# EAGLE design 3dglove_p1 (EAGLE 7.2.0)
DRAWING_AUTHOR: Sean B. Harre
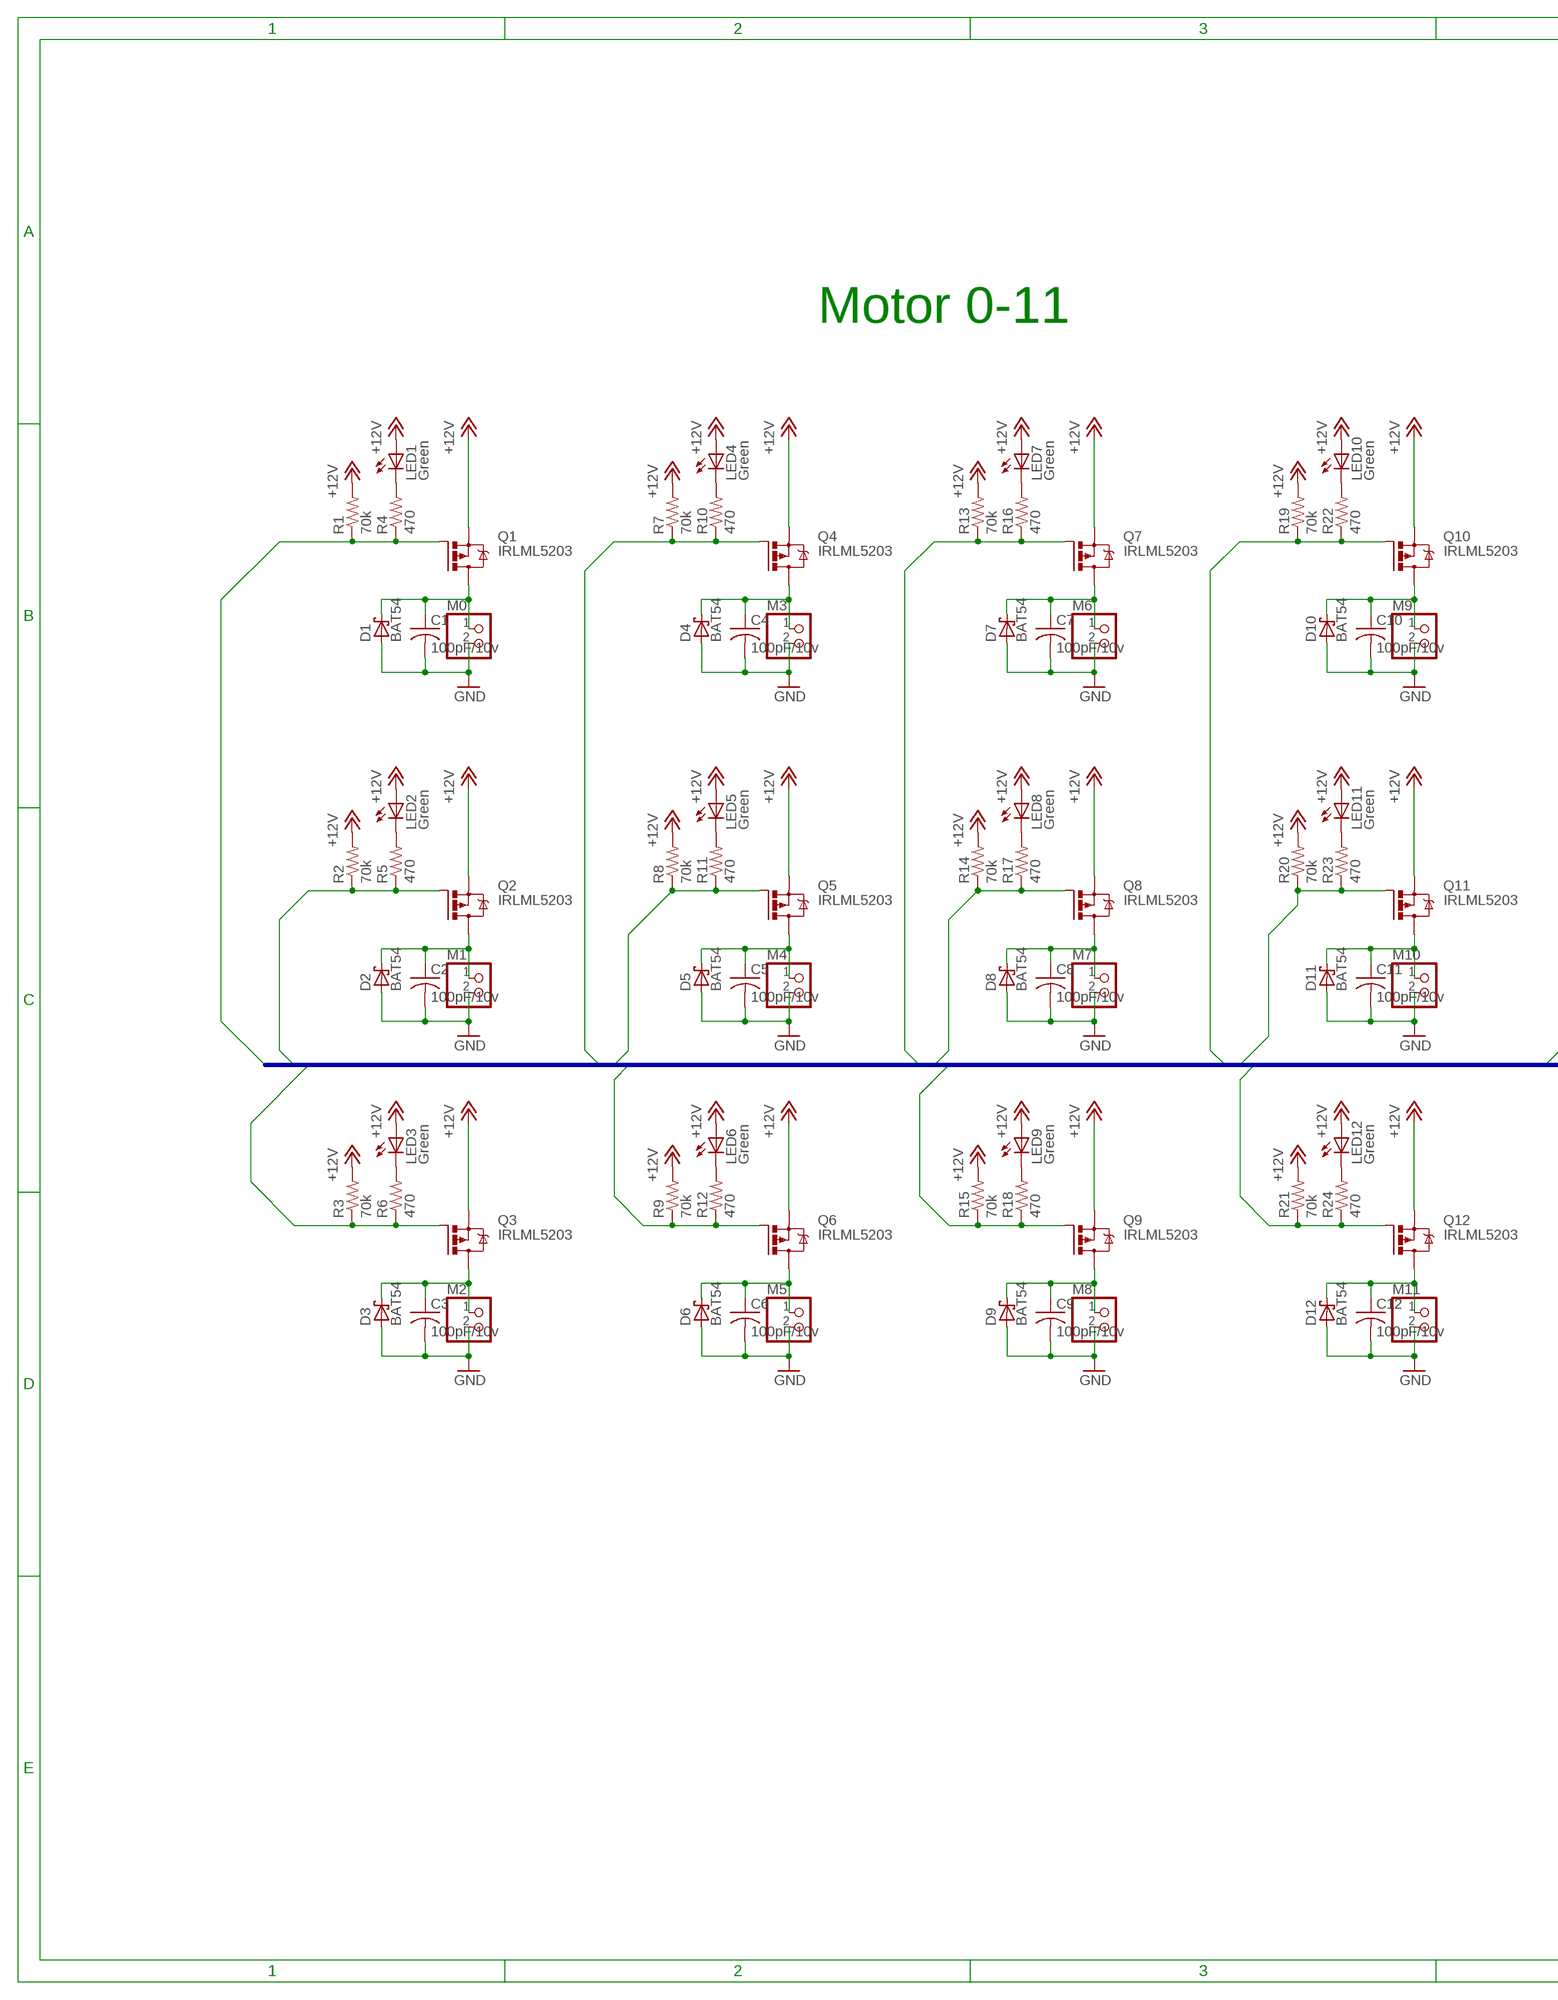
[diagram p0: schematic, sheet 1, part 1 of 2]
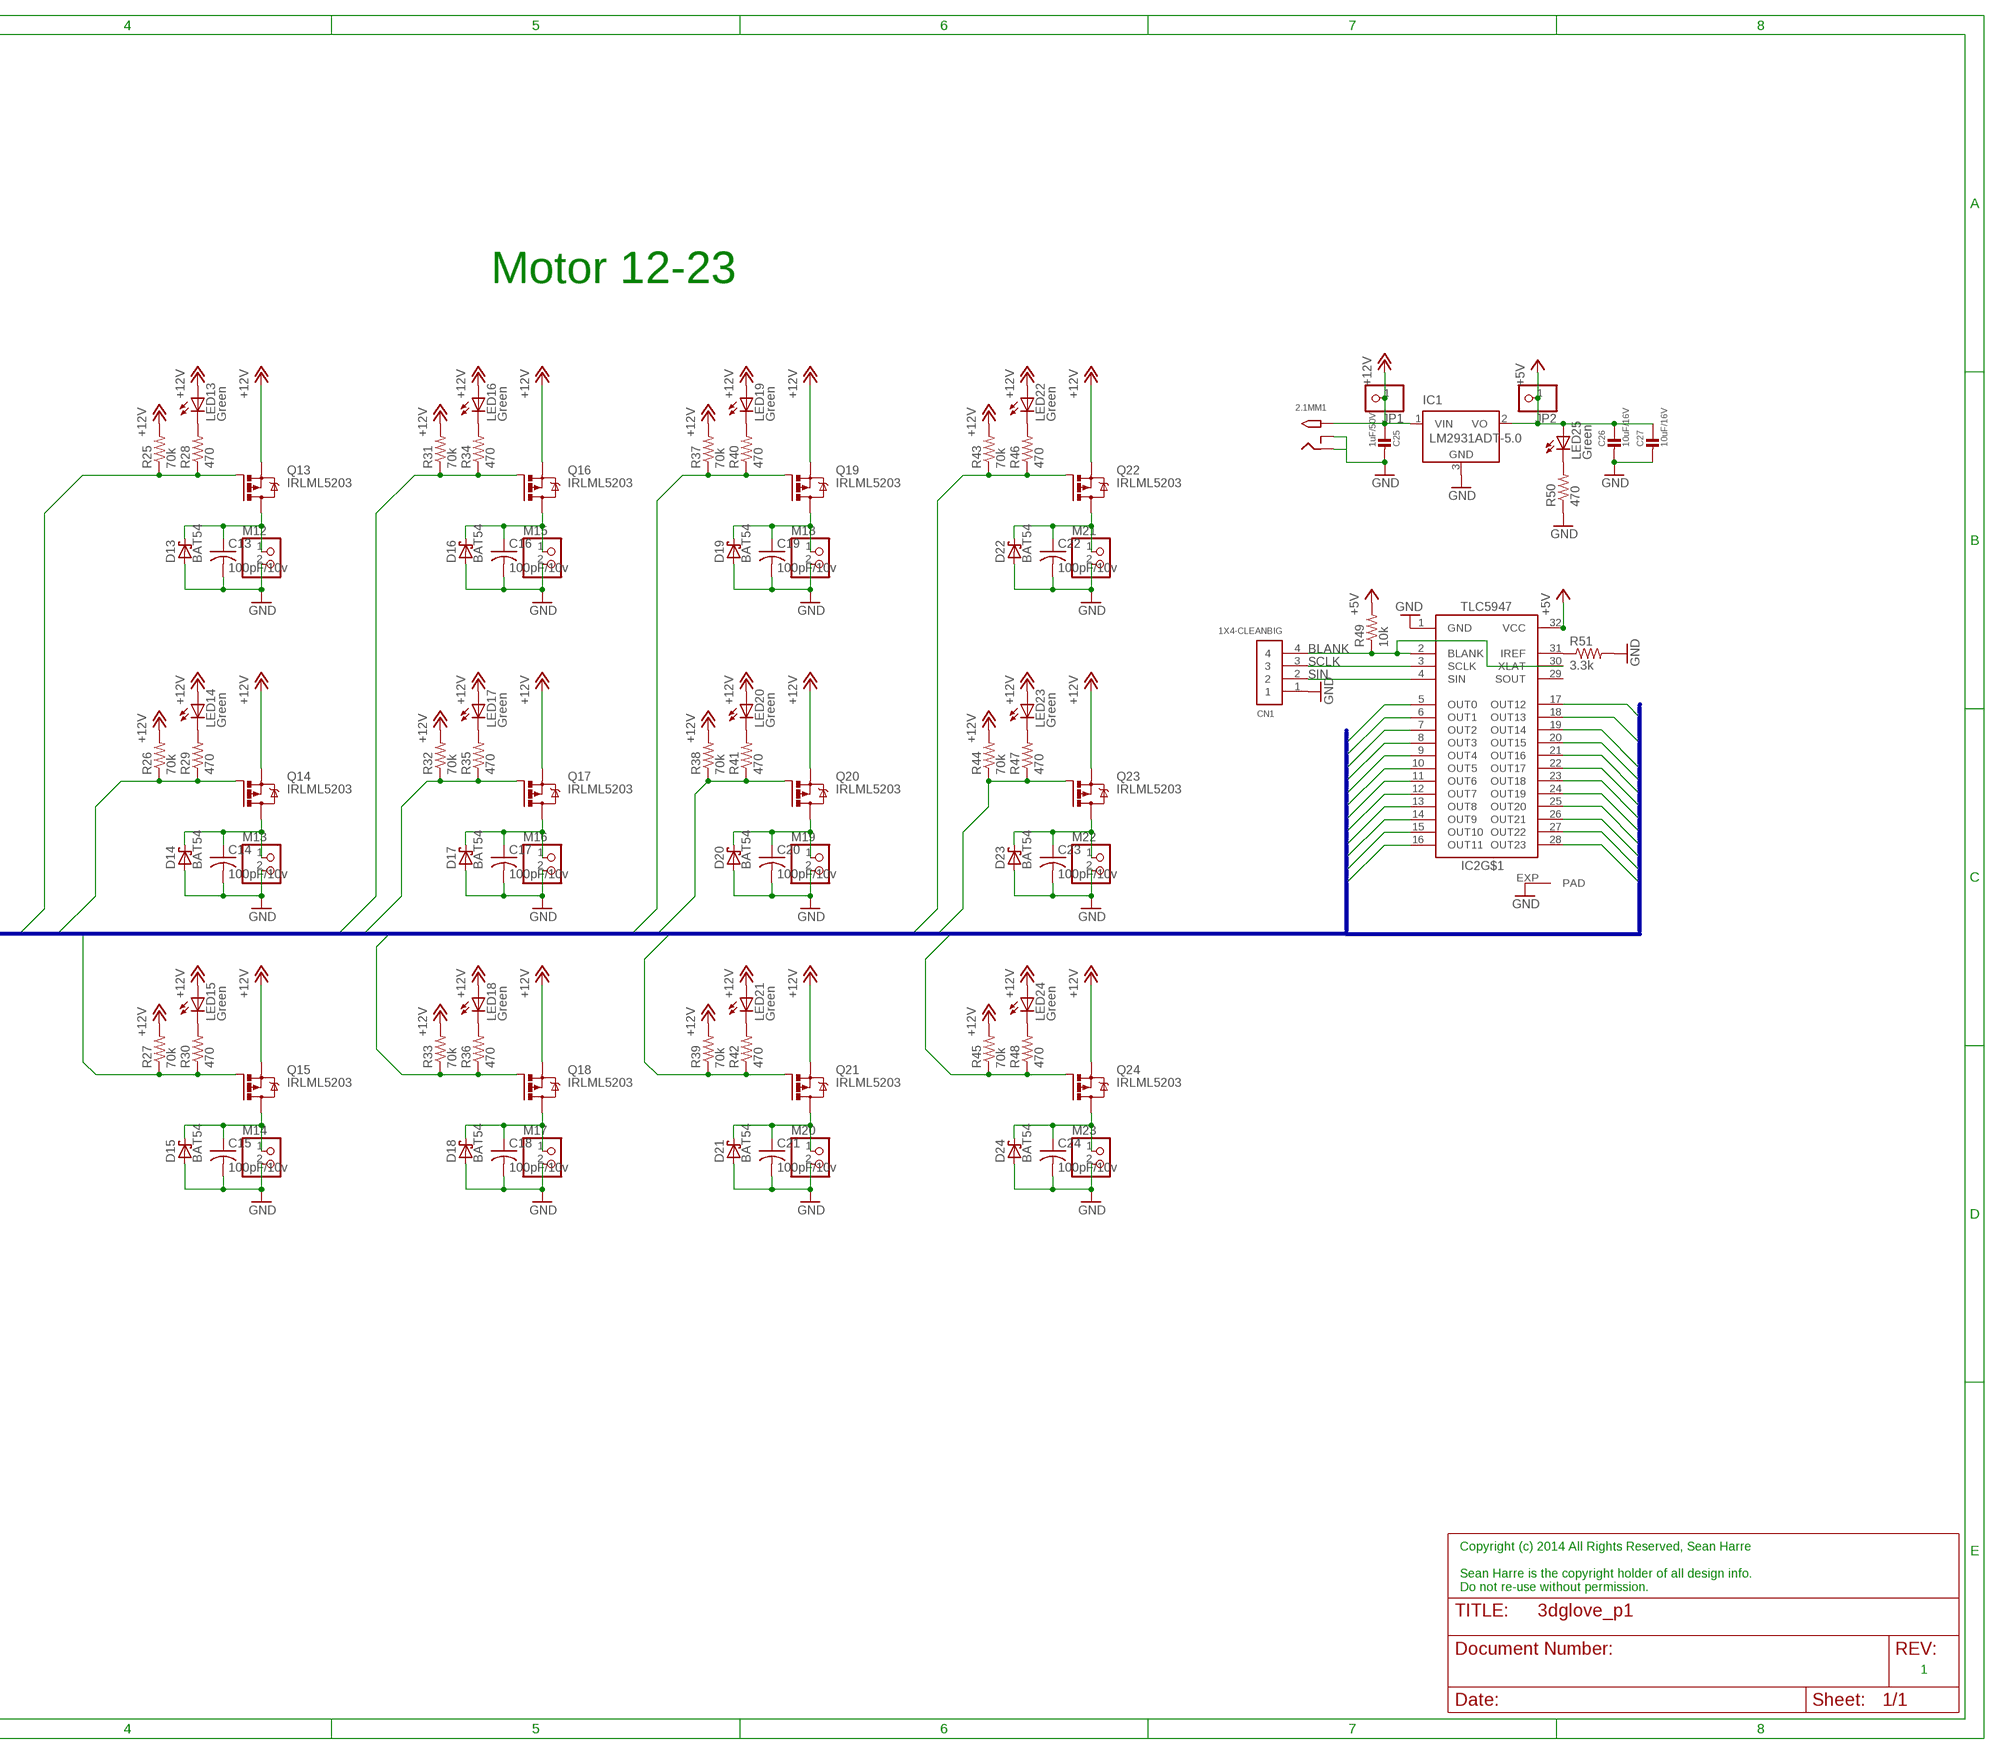
[diagram p1: schematic, sheet 1, part 2 of 2]

## Parts
2.1MM1  2.1MMJACKTHM  [PJ-102A]
C1  100pF/10v  C-USC0402  [C0402]
C2  100pF/10v  C-USC0402  [C0402]
C3  100pF/10v  C-USC0402  [C0402]
C4  100pF/10v  C-USC0402  [C0402]
C5  100pF/10v  C-USC0402  [C0402]
C6  100pF/10v  C-USC0402  [C0402]
C7  100pF/10v  C-USC0402  [C0402]
C8  100pF/10v  C-USC0402  [C0402]
C9  100pF/10v  C-USC0402  [C0402]
C10  100pF/10v  C-USC0402  [C0402]
C11  100pF/10v  C-USC0402  [C0402]
C12  100pF/10v  C-USC0402  [C0402]
C13  100pF/10v  C-USC0402  [C0402]
C14  100pF/10v  C-USC0402  [C0402]
C15  100pF/10v  C-USC0402  [C0402]
C16  100pF/10v  C-USC0402  [C0402]
C17  100pF/10v  C-USC0402  [C0402]
C18  100pF/10v  C-USC0402  [C0402]
C19  100pF/10v  C-USC0402  [C0402]
C20  100pF/10v  C-USC0402  [C0402]
C21  100pF/10v  C-USC0402  [C0402]
C22  100pF/10v  C-USC0402  [C0402]
C23  100pF/10v  C-USC0402  [C0402]
C24  100pF/10v  C-USC0402  [C0402]
C25  1uF/50V  CAP_CERAMIC0805  [0805]
C26  10uF/16V  CAP_CERAMIC0805  [0805]
C27  10uF/16V  CAP_CERAMIC0805  [0805]
CN1  1X4-CLEANBIG  [1X04-CLEANBIG]
D1  BAT54  [SOT23]
D2  BAT54  [SOT23]
D3  BAT54  [SOT23]
D4  BAT54  [SOT23]
D5  BAT54  [SOT23]
D6  BAT54  [SOT23]
D7  BAT54  [SOT23]
D8  BAT54  [SOT23]
D9  BAT54  [SOT23]
D10  BAT54  [SOT23]
D11  BAT54  [SOT23]
D12  BAT54  [SOT23]
D13  BAT54  [SOT23]
D14  BAT54  [SOT23]
D15  BAT54  [SOT23]
D16  BAT54  [SOT23]
D17  BAT54  [SOT23]
D18  BAT54  [SOT23]
D19  BAT54  [SOT23]
D20  BAT54  [SOT23]
D21  BAT54  [SOT23]
D22  BAT54  [SOT23]
D23  BAT54  [SOT23]
D24  BAT54  [SOT23]
IC1  LM2931ADT-5.0  LM2936DT-3.3  [TO252]
IC2  TLC5947-DAP  [HTSSOP32DAP]
JP1  PINHD-1X1CB  [1X01-CLEANBIG]
JP2  PINHD-1X1CB  [1X01-CLEANBIG]
LED1  Green  LEDCHIP-LED0805  [CHIP-LED0805]
LED2  Green  LEDCHIP-LED0805  [CHIP-LED0805]
LED3  Green  LEDCHIP-LED0805  [CHIP-LED0805]
LED4  Green  LEDCHIP-LED0805  [CHIP-LED0805]
LED5  Green  LEDCHIP-LED0805  [CHIP-LED0805]
LED6  Green  LEDCHIP-LED0805  [CHIP-LED0805]
LED7  Green  LEDCHIP-LED0805  [CHIP-LED0805]
LED8  Green  LEDCHIP-LED0805  [CHIP-LED0805]
LED9  Green  LEDCHIP-LED0805  [CHIP-LED0805]
LED10  Green  LEDCHIP-LED0805  [CHIP-LED0805]
LED11  Green  LEDCHIP-LED0805  [CHIP-LED0805]
LED12  Green  LEDCHIP-LED0805  [CHIP-LED0805]
LED13  Green  LEDCHIP-LED0805  [CHIP-LED0805]
LED14  Green  LEDCHIP-LED0805  [CHIP-LED0805]
LED15  Green  LEDCHIP-LED0805  [CHIP-LED0805]
LED16  Green  LEDCHIP-LED0805  [CHIP-LED0805]
LED17  Green  LEDCHIP-LED0805  [CHIP-LED0805]
LED18  Green  LEDCHIP-LED0805  [CHIP-LED0805]
LED19  Green  LEDCHIP-LED0805  [CHIP-LED0805]
LED20  Green  LEDCHIP-LED0805  [CHIP-LED0805]
LED21  Green  LEDCHIP-LED0805  [CHIP-LED0805]
LED22  Green  LEDCHIP-LED0805  [CHIP-LED0805]
LED23  Green  LEDCHIP-LED0805  [CHIP-LED0805]
LED24  Green  LEDCHIP-LED0805  [CHIP-LED0805]
LED25  Green  LEDCHIP-LED0805  [CHIP-LED0805]
M0  PINHD-1X2  [1X02]
M1  PINHD-1X2  [1X02]
M2  PINHD-1X2  [1X02]
M3  PINHD-1X2  [1X02]
M4  PINHD-1X2  [1X02]
M5  PINHD-1X2  [1X02]
M6  PINHD-1X2  [1X02]
M7  PINHD-1X2  [1X02]
M8  PINHD-1X2  [1X02]
M9  PINHD-1X2  [1X02]
M10  PINHD-1X2  [1X02]
M11  PINHD-1X2  [1X02]
M12  PINHD-1X2  [1X02]
M13  PINHD-1X2  [1X02]
M14  PINHD-1X2  [1X02]
M15  PINHD-1X2  [1X02]
M16  PINHD-1X2  [1X02]
M17  PINHD-1X2  [1X02]
M18  PINHD-1X2  [1X02]
M19  PINHD-1X2  [1X02]
M20  PINHD-1X2  [1X02]
M21  PINHD-1X2  [1X02]
M22  PINHD-1X2  [1X02]
M23  PINHD-1X2  [1X02]
Q1  IRLML5203  [MICRO3]
Q2  IRLML5203  [MICRO3]
Q3  IRLML5203  [MICRO3]
Q4  IRLML5203  [MICRO3]
Q5  IRLML5203  [MICRO3]
Q6  IRLML5203  [MICRO3]
Q7  IRLML5203  [MICRO3]
Q8  IRLML5203  [MICRO3]
Q9  IRLML5203  [MICRO3]
Q10  IRLML5203  [MICRO3]
Q11  IRLML5203  [MICRO3]
Q12  IRLML5203  [MICRO3]
Q13  IRLML5203  [MICRO3]
Q14  IRLML5203  [MICRO3]
Q15  IRLML5203  [MICRO3]
Q16  IRLML5203  [MICRO3]
Q17  IRLML5203  [MICRO3]
Q18  IRLML5203  [MICRO3]
Q19  IRLML5203  [MICRO3]
Q20  IRLML5203  [MICRO3]
Q21  IRLML5203  [MICRO3]
Q22  IRLML5203  [MICRO3]
Q23  IRLML5203  [MICRO3]
Q24  IRLML5203  [MICRO3]
R1  70k  R-US_R0402  [R0402]
R2  70k  R-US_R0402  [R0402]
R3  70k  R-US_R0402  [R0402]
R4  470  R-US_R1206  [R1206]
R5  470  R-US_R1206  [R1206]
R6  470  R-US_R1206  [R1206]
R7  70k  R-US_R0402  [R0402]
R8  70k  R-US_R0402  [R0402]
R9  70k  R-US_R0402  [R0402]
R10  470  R-US_R1206  [R1206]
R11  470  R-US_R1206  [R1206]
R12  470  R-US_R1206  [R1206]
R13  70k  R-US_R0402  [R0402]
R14  70k  R-US_R0402  [R0402]
R15  70k  R-US_R0402  [R0402]
R16  470  R-US_R1206  [R1206]
R17  470  R-US_R1206  [R1206]
R18  470  R-US_R1206  [R1206]
R19  70k  R-US_R0402  [R0402]
R20  70k  R-US_R0402  [R0402]
R21  70k  R-US_R0402  [R0402]
R22  470  R-US_R1206  [R1206]
R23  470  R-US_R1206  [R1206]
R24  470  R-US_R1206  [R1206]
R25  70k  R-US_R0402  [R0402]
R26  70k  R-US_R0402  [R0402]
R27  70k  R-US_R0402  [R0402]
R28  470  R-US_R1206  [R1206]
R29  470  R-US_R1206  [R1206]
R30  470  R-US_R1206  [R1206]
R31  70k  R-US_R0402  [R0402]
R32  70k  R-US_R0402  [R0402]
R33  70k  R-US_R0402  [R0402]
R34  470  R-US_R1206  [R1206]
R35  470  R-US_R1206  [R1206]
R36  470  R-US_R1206  [R1206]
R37  70k  R-US_R0402  [R0402]
R38  70k  R-US_R0402  [R0402]
R39  70k  R-US_R0402  [R0402]
R40  470  R-US_R1206  [R1206]
R41  470  R-US_R1206  [R1206]
R42  470  R-US_R1206  [R1206]
R43  70k  R-US_R0402  [R0402]
R44  70k  R-US_R0402  [R0402]
R45  70k  R-US_R0402  [R0402]
R46  470  R-US_R1206  [R1206]
R47  470  R-US_R1206  [R1206]
R48  470  R-US_R1206  [R1206]
R49  10k  R-US_R0402  [R0402]
R50  470  R-US_R0402  [R0402]
R51  3.3k  R-US_R0402  [R0402]

## Nets
+5V: C26.1 C27.1 IC1.2(VO) IC2.32(VCC) JP2.1 LED25.A R49.2
+12V [power]: 2.1MM1.TIP C25.1 IC1.1(VIN) JP1.1 LED1.A LED2.A LED3.A LED4.A LED5.A LED6.A LED7.A LED8.A LED9.A LED10.A LED11.A LED12.A LED13.A LED14.A LED15.A LED16.A LED17.A LED18.A LED19.A LED20.A LED21.A LED22.A LED23.A LED24.A Q1.2(S) Q2.2(S) Q3.2(S) Q4.2(S) Q5.2(S) Q6.2(S) Q7.2(S) Q8.2(S) Q9.2(S) Q10.2(S) Q11.2(S) Q12.2(S) Q13.2(S) Q14.2(S) Q15.2(S) Q16.2(S) Q17.2(S) Q18.2(S) Q19.2(S) Q20.2(S) Q21.2(S) Q22.2(S) Q23.2(S) Q24.2(S) R1.2 R2.2 R3.2 R7.2 R8.2 R9.2 R13.2 R14.2 R15.2 R19.2 R20.2 R21.2 R25.2 R26.2 R27.2 R31.2 R32.2 R33.2 R37.2 R38.2 R39.2 R43.2 R44.2 R45.2
BLANK: CN1.4 IC2.2(BLANK) IC2.30(XLAT) R49.1
GND: 2.1MM1.RING 2.1MM1.RING_SW C1.2 C2.2 C3.2 C4.2 C5.2 C6.2 C7.2 C8.2 C9.2 C10.2 C11.2 C12.2 C13.2 C14.2 C15.2 C16.2 C17.2 C18.2 C19.2 C20.2 C21.2 C22.2 C23.2 C24.2 C25.2 C26.2 C27.2 CN1.1 D1.1(A) D2.1(A) D3.1(A) D4.1(A) D5.1(A) D6.1(A) D7.1(A) D8.1(A) D9.1(A) D10.1(A) D11.1(A) D12.1(A) D13.1(A) D14.1(A) D15.1(A) D16.1(A) D17.1(A) D18.1(A) D19.1(A) D20.1(A) D21.1(A) D22.1(A) D23.1(A) D24.1(A) IC1.3(GND) IC2.1(GND) IC2.EXP(PAD) M0.2 M1.2 M2.2 M3.2 M4.2 M5.2 M6.2 M7.2 M8.2 M9.2 M10.2 M11.2 M12.2 M13.2 M14.2 M15.2 M16.2 M17.2 M18.2 M19.2 M20.2 M21.2 M22.2 M23.2 R50.1 R51.2
N$1: LED25.C R50.2
N$2: IC2.31(IREF) R51.1
N$3: LED13.C R28.2
N$5: C13.1 D13.3(C) M12.1 Q13.3(D)
N$6: LED14.C R29.2
N$8: C14.1 D14.3(C) M13.1 Q14.3(D)
N$9: LED15.C R30.2
N$11: C15.1 D15.3(C) M14.1 Q15.3(D)
N$12: LED16.C R34.2
N$14: C16.1 D16.3(C) M15.1 Q16.3(D)
N$15: LED17.C R35.2
N$17: C17.1 D17.3(C) M16.1 Q17.3(D)
N$18: LED18.C R36.2
N$20: C18.1 D18.3(C) M17.1 Q18.3(D)
N$21: LED19.C R40.2
N$23: C19.1 D19.3(C) M18.1 Q19.3(D)
N$24: LED20.C R41.2
N$26: C20.1 D20.3(C) M19.1 Q20.3(D)
N$27: LED21.C R42.2
N$29: C21.1 D21.3(C) M20.1 Q21.3(D)
N$30: LED22.C R46.2
N$32: C22.1 D22.3(C) M21.1 Q22.3(D)
N$33: LED23.C R47.2
N$35: C23.1 D23.3(C) M22.1 Q23.3(D)
N$36: LED24.C R48.2
N$38: C24.1 D24.3(C) M23.1 Q24.3(D)
N$39: LED1.C R4.2
N$41: C1.1 D1.3(C) M0.1 Q1.3(D)
N$42: LED2.C R5.2
N$44: C2.1 D2.3(C) M1.1 Q2.3(D)
N$45: LED3.C R6.2
N$47: C3.1 D3.3(C) M2.1 Q3.3(D)
N$48: LED4.C R10.2
N$50: C4.1 D4.3(C) M3.1 Q4.3(D)
N$51: LED5.C R11.2
N$53: C5.1 D5.3(C) M4.1 Q5.3(D)
N$54: LED6.C R12.2
N$56: C6.1 D6.3(C) M5.1 Q6.3(D)
N$57: LED7.C R16.2
N$59: C7.1 D7.3(C) M6.1 Q7.3(D)
N$60: LED8.C R17.2
N$62: C8.1 D8.3(C) M7.1 Q8.3(D)
N$63: LED9.C R18.2
N$65: C9.1 D9.3(C) M8.1 Q9.3(D)
N$66: LED10.C R22.2
N$68: C10.1 D10.3(C) M9.1 Q10.3(D)
N$69: LED11.C R23.2
N$71: C11.1 D11.3(C) M10.1 Q11.3(D)
N$72: LED12.C R24.2
N$74: C12.1 D12.3(C) M11.1 Q12.3(D)
OUT0: IC2.5(OUT0) Q1.1(G) R1.1 R4.1
OUT1: IC2.6(OUT1) Q2.1(G) R2.1 R5.1
OUT2: IC2.7(OUT2) Q3.1(G) R3.1 R6.1
OUT3: IC2.8(OUT3) Q4.1(G) R7.1 R10.1
OUT4: IC2.9(OUT4) Q5.1(G) R8.1 R11.1
OUT5: IC2.10(OUT5) Q6.1(G) R9.1 R12.1
OUT6: IC2.11(OUT6) Q7.1(G) R13.1 R16.1
OUT7: IC2.12(OUT7) Q8.1(G) R14.1 R17.1
OUT8: IC2.13(OUT8) Q9.1(G) R15.1 R18.1
OUT9: IC2.14(OUT9) Q10.1(G) R19.1 R22.1
OUT10: IC2.15(OUT10) Q11.1(G) R20.1 R23.1
OUT11: IC2.16(OUT11) Q12.1(G) R21.1 R24.1
OUT12: IC2.17(OUT12) Q13.1(G) R25.1 R28.1
OUT13: IC2.18(OUT13) Q14.1(G) R26.1 R29.1
OUT14: IC2.19(OUT14) Q15.1(G) R27.1 R30.1
OUT15: IC2.20(OUT15) Q16.1(G) R31.1 R34.1
OUT16: IC2.21(OUT16) Q17.1(G) R32.1 R35.1
OUT17: IC2.22(OUT17) Q18.1(G) R33.1 R36.1
OUT18: IC2.23(OUT18) Q19.1(G) R37.1 R40.1
OUT19: IC2.24(OUT19) Q20.1(G) R38.1 R41.1
OUT20: IC2.25(OUT20) Q21.1(G) R39.1 R42.1
OUT21: IC2.26(OUT21) Q22.1(G) R43.1 R46.1
OUT22: IC2.27(OUT22) Q23.1(G) R44.1 R47.1
OUT23: IC2.28(OUT23) Q24.1(G) R45.1 R48.1
SCLK: CN1.3 IC2.3(SCLK)
SIN: CN1.2 IC2.4(SIN)
Unconnected: IC2.29(SOUT)

## Buses
OUT[0..23]

## Notes on the sheet
- Motor 0-11 | Motor 12-23
- Copyright (c) 2014 All Rights Reserved, Sean Harre
  
  Sean Harre is the copyright holder of all design info.
  Do not re-use without permission.
- 1

## Library data of the parts
2.1MM1 = adafruit:2.1MMJACK: 2.1mm x 5.5mm THM DC jack with internal switch. Digikey part #PJ-102A, 4UCON part #05537 2.1mm x 5.5mm SMT DC jack with internal switch. Digikey part #PJ-002A-SMT, 4UCON part #03267 By microbuilder.eu & adafruit.com; MF: FARNELL; MPN: DC10A; OC_NEWARK: 08WX2563
C1-C24 = rcl:C-US: CAPACITOR, American symbol; MPN: MCMT15N101F100CT; OC_NEWARK: 23T7076
C25 = microbuilder:CAP_CERAMIC: Ceramic Capacitors For new designs, use the packages preceded by an '_' character since they are more reliable: The following footprints should be used on most boards: _0402 - Standard footprint for regular board layouts _0603 - Standard footprint for regular board layouts _0805 - Standard footprint for regular board layouts For extremely tight-pitch boards where space is at a premium, the following 'micro-pitch' footprints can be used (smaller pads, no silkscreen outline, etc.): _0402MP - Micro-pitch footprint for very dense/compact boards _0603MP - Micro-pitch footprint for very dense/compact boards _0805MP - Micro-pitch footprint for very dense/compact boards Commonly Stocked Parts 0402 - 0402 Surface Mount Capacitors 16pF 50V 5% [Digikey: 445-4899-2-ND] 18pF 50V 5% [Digikey: 490-1281-2-ND] 22pF 50V 5% [Digikey: 490-1283-2-ND] 68pF 50V 5% [Digikey: 490-1289-2-ND] 0.1uF 10V 10% [Digikey: 490-1318-2-ND] 1.0uF 6.3V 10% [Digikey: 490-1320-2-ND] 0603 - 0603 Surface Mount Capacitors 16 pF 50V 5% [Digikey: 445-5051-2-ND] 22 pF 50V [Digikey: PCC220ACVTR-ND] 33 pF 50V 5% [Digikey: 490-1415-1-ND] 56pF 50V 5% [Digikey: 490-1421-1-ND] 220pF 50V 5% [Digikey: 445-1285-1-ND] 680 pF 50V 2200 pF 50V 5% C0G [Digikey: 445-1297-1-ND] 5600 pF 100V 5% X7R [Digikey: 478-3711-1-ND] 0.1 µF 25V 10% [Digikey: PCC2277TR-ND] 0.22 µF 16V 10% X7R [Digikey: 445-1318-1-ND] 1.0 µF 25V 10% [Digikey: 445-5146-2-ND] 0603 - RF Specific 3pF 250V +/-0.1pF RF [Digikey: 712-1347-1-ND] 18 pF 250V 5% [Digikey: 478-3505-1-ND or 712-1322-1-ND] 56 pF 250V 5% C0G RF [Digikey: 490-4867-1-ND] 68 pF 250V RF [Digikey: 490-4868-1-ND] 0805 - 0805 Surface Mount Capacitors 220 pF 250V 2% RF Ceramic Capacitor [Digikey: 712-1398-1-ND] 1000 pF 50V 2% NP0 Ceramic Capacitor [Digikey: 478-3760-1-ND] 0.1 µF 25V 10% Ceramic Capacitor [Digikey: PCC1828TR-ND] 1.0 µF 16V 10% Ceramic Capacitor[Digikey: 490-1691-2-ND] 10.0 µF 10V 10% Ceramic Capacitor[Digikey: 709-1228-1-ND] 10.0 uF 16V 10% Ceramic Capacitor [Digikey: 478-5165-2-ND] 47 uF 6.3V 20% Ceramic Capacitor [Digikey: 587-1779-1-ND or 399-5506-1-ND] 1206 - 1206 Surface Mount Capacitors 47uF 10V 20% Ceramic Capacitor [Digikey: 490-5528-1-ND or 399-5508-1-ND or 445-6010-1-ND] 100uF 6.3V -20%, +80% Y5V Ceramic Capacitor (Digikey: 490-4512-1-ND, Mouser: 81-GRM31CF50J107ZE1L); MPN: C2012X7R1H105K125AB; OC_NEWARK: 04X3289
C26 C27 = microbuilder:CAP_CERAMIC: Ceramic Capacitors For new designs, use the packages preceded by an '_' character since they are more reliable: The following footprints should be used on most boards: _0402 - Standard footprint for regular board layouts _0603 - Standard footprint for regular board layouts _0805 - Standard footprint for regular board layouts For extremely tight-pitch boards where space is at a premium, the following 'micro-pitch' footprints can be used (smaller pads, no silkscreen outline, etc.): _0402MP - Micro-pitch footprint for very dense/compact boards _0603MP - Micro-pitch footprint for very dense/compact boards _0805MP - Micro-pitch footprint for very dense/compact boards Commonly Stocked Parts 0402 - 0402 Surface Mount Capacitors 16pF 50V 5% [Digikey: 445-4899-2-ND] 18pF 50V 5% [Digikey: 490-1281-2-ND] 22pF 50V 5% [Digikey: 490-1283-2-ND] 68pF 50V 5% [Digikey: 490-1289-2-ND] 0.1uF 10V 10% [Digikey: 490-1318-2-ND] 1.0uF 6.3V 10% [Digikey: 490-1320-2-ND] 0603 - 0603 Surface Mount Capacitors 16 pF 50V 5% [Digikey: 445-5051-2-ND] 22 pF 50V [Digikey: PCC220ACVTR-ND] 33 pF 50V 5% [Digikey: 490-1415-1-ND] 56pF 50V 5% [Digikey: 490-1421-1-ND] 220pF 50V 5% [Digikey: 445-1285-1-ND] 680 pF 50V 2200 pF 50V 5% C0G [Digikey: 445-1297-1-ND] 5600 pF 100V 5% X7R [Digikey: 478-3711-1-ND] 0.1 µF 25V 10% [Digikey: PCC2277TR-ND] 0.22 µF 16V 10% X7R [Digikey: 445-1318-1-ND] 1.0 µF 25V 10% [Digikey: 445-5146-2-ND] 0603 - RF Specific 3pF 250V +/-0.1pF RF [Digikey: 712-1347-1-ND] 18 pF 250V 5% [Digikey: 478-3505-1-ND or 712-1322-1-ND] 56 pF 250V 5% C0G RF [Digikey: 490-4867-1-ND] 68 pF 250V RF [Digikey: 490-4868-1-ND] 0805 - 0805 Surface Mount Capacitors 220 pF 250V 2% RF Ceramic Capacitor [Digikey: 712-1398-1-ND] 1000 pF 50V 2% NP0 Ceramic Capacitor [Digikey: 478-3760-1-ND] 0.1 µF 25V 10% Ceramic Capacitor [Digikey: PCC1828TR-ND] 1.0 µF 16V 10% Ceramic Capacitor[Digikey: 490-1691-2-ND] 10.0 µF 10V 10% Ceramic Capacitor[Digikey: 709-1228-1-ND] 10.0 uF 16V 10% Ceramic Capacitor [Digikey: 478-5165-2-ND] 47 uF 6.3V 20% Ceramic Capacitor [Digikey: 587-1779-1-ND or 399-5506-1-ND] 1206 - 1206 Surface Mount Capacitors 47uF 10V 20% Ceramic Capacitor [Digikey: 490-5528-1-ND or 399-5508-1-ND or 445-6010-1-ND] 100uF 6.3V -20%, +80% Y5V Ceramic Capacitor (Digikey: 490-4512-1-ND, Mouser: 81-GRM31CF50J107ZE1L); MPN: C2012X5R1C106K085AC; OC_NEWARK: 04X3273
CN1 = adafruit:1X4: 4-pin connector; OC_NEWARK: unknown
D1-D24 = diode:BAT54: Schottky Diodes Source: Fairchild .. BAT54.pdf; MF: ON SEMICONDUCTOR; MPN: BAT54LT1G; OC_NEWARK: 88H4553
IC1 = national-semiconductor:LM2936?*: Ultra-Low Quiescent Current LDO Voltage Regulator Source: Data sheet <http://www.national.com/ds/LM/LM2936.pdf>; MPN: LM2936DT-3.3.; OC_FARNELL: 1286863; OC_NEWARK: 26M0361
IC2 = adafruit:TLC5947; MPN: TLC5947DAP; OC_NEWARK: 03P5011
JP1 JP2 = adafruit:PINHD-1X1: Pin header 1x1 for 0.1" spacing With round pins; OC_NEWARK: unknown
LED1-LED25 = adafruit:LED: LED OSRAM: - CHIPLED LG R971, LG N971, LY N971, LG Q971, LY Q971, LO R971, LY R971 LH N974, LH R974 LS Q976, LO Q976, LY Q976 LO Q996 - Hyper CHIPLED LW Q18S LB Q993, LB Q99A, LB R99A - SideLED LS A670, LO A670, LY A670, LG A670, LP A670 LB A673, LV A673, LT A673, LW A673 LH A674 LY A675 LS A676, LA A676, LO A676, LY A676, LW A676 LS A679, LY A679, LG A679 - Hyper Micro SIDELED® LS Y876, LA Y876, LO Y876, LY Y876 LT Y87S - SmartLED LW L88C, LW L88S LB L89C, LB L89S, LG L890 LS L89K, LO L89K, LY L89K LS L896, LA L896, LO L896, LY L896 - TOPLED LS T670, LO T670, LY T670, LG T670, LP T670 LSG T670, LSP T670, LSY T670, LOP T670, LYG T670 LG T671, LOG T671, LSG T671 LB T673, LV T673, LT T673, LW T673 LH T674 LS T676, LA T676, LO T676, LY T676, LB T676, LH T676, LSB T676, LW T676 LB T67C, LV T67C, LT T67C, LS T67K, LO T67K, LY T67K, LW E67C LS E67B, LA E67B, LO E67B, LY E67B, LB E67C, LV E67C, LT E67C LW T67C LS T679, LY T679, LG T679 LS T770, LO T770, LY T770, LG T770, LP T770 LB T773, LV T773, LT T773, LW T773 LH T774 LS E675, LA E675, LY E675, LS T675 LS T776, LA T776, LO T776, LY T776, LB T776 LHGB T686 LT T68C, LB T68C - Hyper Mini TOPLED® LB M676 - Mini TOPLED Santana® LG M470 LS M47K, LO M47K, LY M47K Source: http://www.osram.convergy.de/; OC_NEWARK: unknown
M0 M1-M23 = pinhead:PINHD-1X2: PIN HEADER; OC_NEWARK: unknown
Q1-Q24 = transistor-power:IRLML5203: HEXFET P-Channel Power MOSFET; MPN: IRLML5203GTRPBF; OC_NEWARK: 10R3520
R1-R3 R7-R9 R13-R15 R19-R21 R25-R27 R31-R33 R37-R39 R43-R45 = adafruit:R-US_: RESISTOR, American symbol; MPN: ERJ-2GEJ683X; OC_NEWARK: 53W4177
R4-R6 R10-R12 R16-R18 R22-R24 R28-R30 R34-R36 R40-R42 R46-R48 = adafruit:R-US_: RESISTOR, American symbol; MPN: MCHP06W2F4700T5E; OC_NEWARK: 01N7182
R49 = rcl:R-US_: RESISTOR, American symbol; MPN: TNPW040210K0BEED; OC_NEWARK: 11R2753
R50 = rcl:R-US_: RESISTOR, American symbol; MPN: ERJ-U02F4700X; OC_NEWARK: 51W3294
R51 = rcl:R-US_: RESISTOR, American symbol; MPN: M55342K11B3E30STIV; OC_NEWARK: 06Y4180

## Net classes
1 power: width 0.508 mm, drill 0.61 mm, clearance 0.203 mm
2 ground: width 0.508 mm, drill 0.61 mm, clearance 0.203 mm

## Board
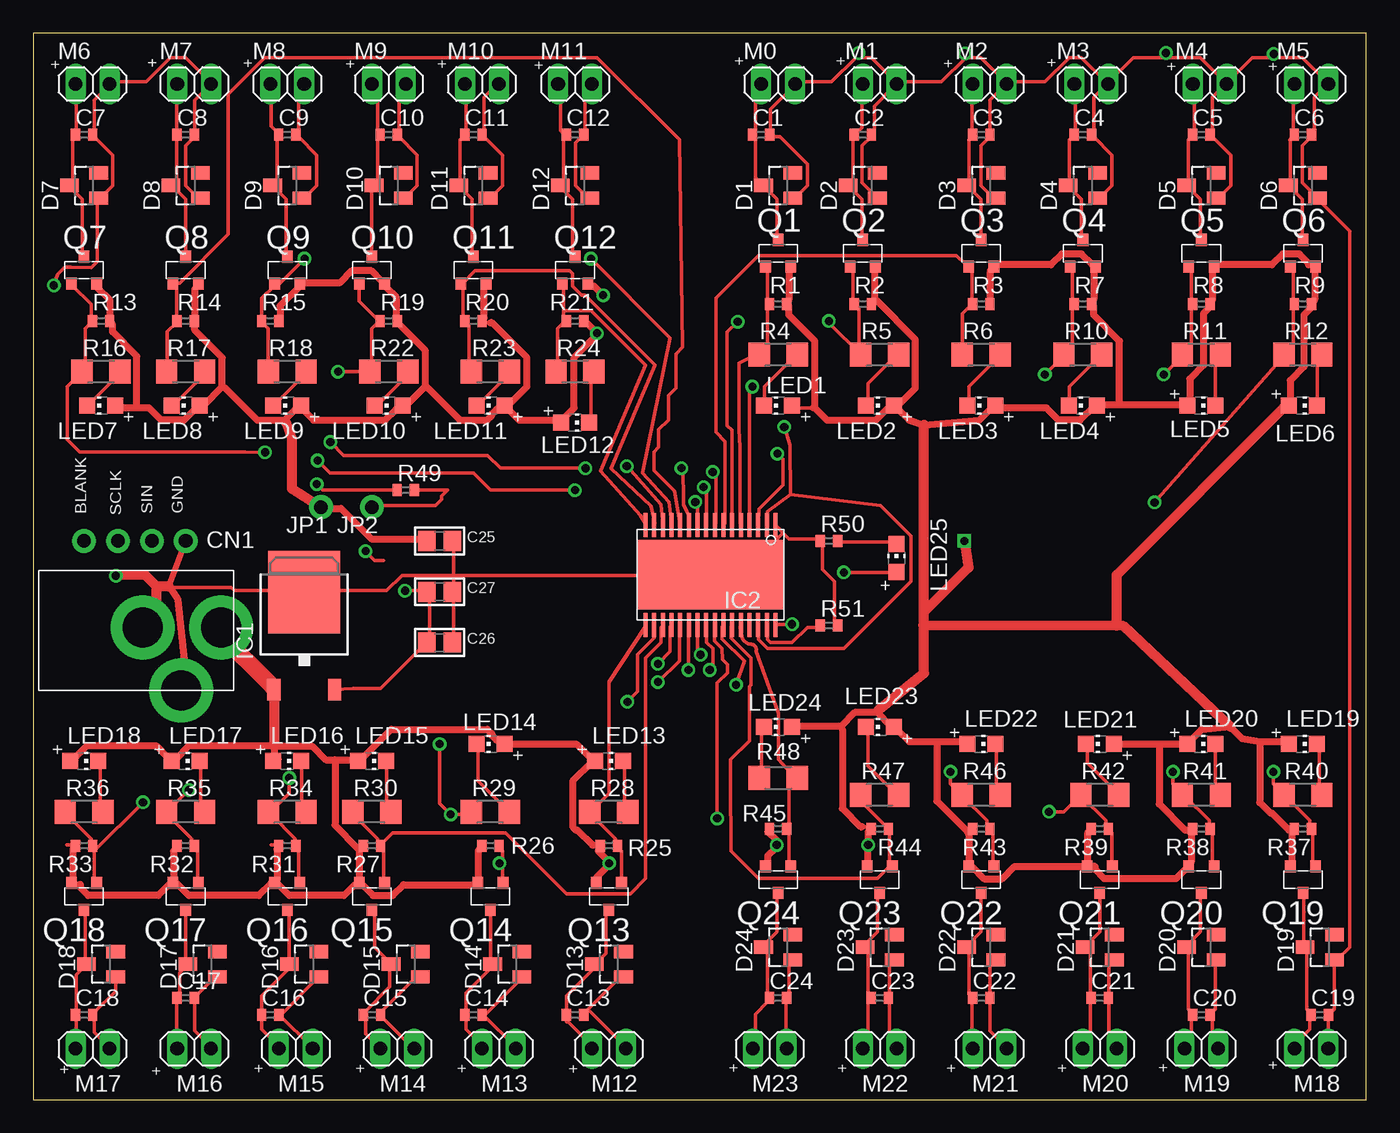
[diagram p2: board, top side]
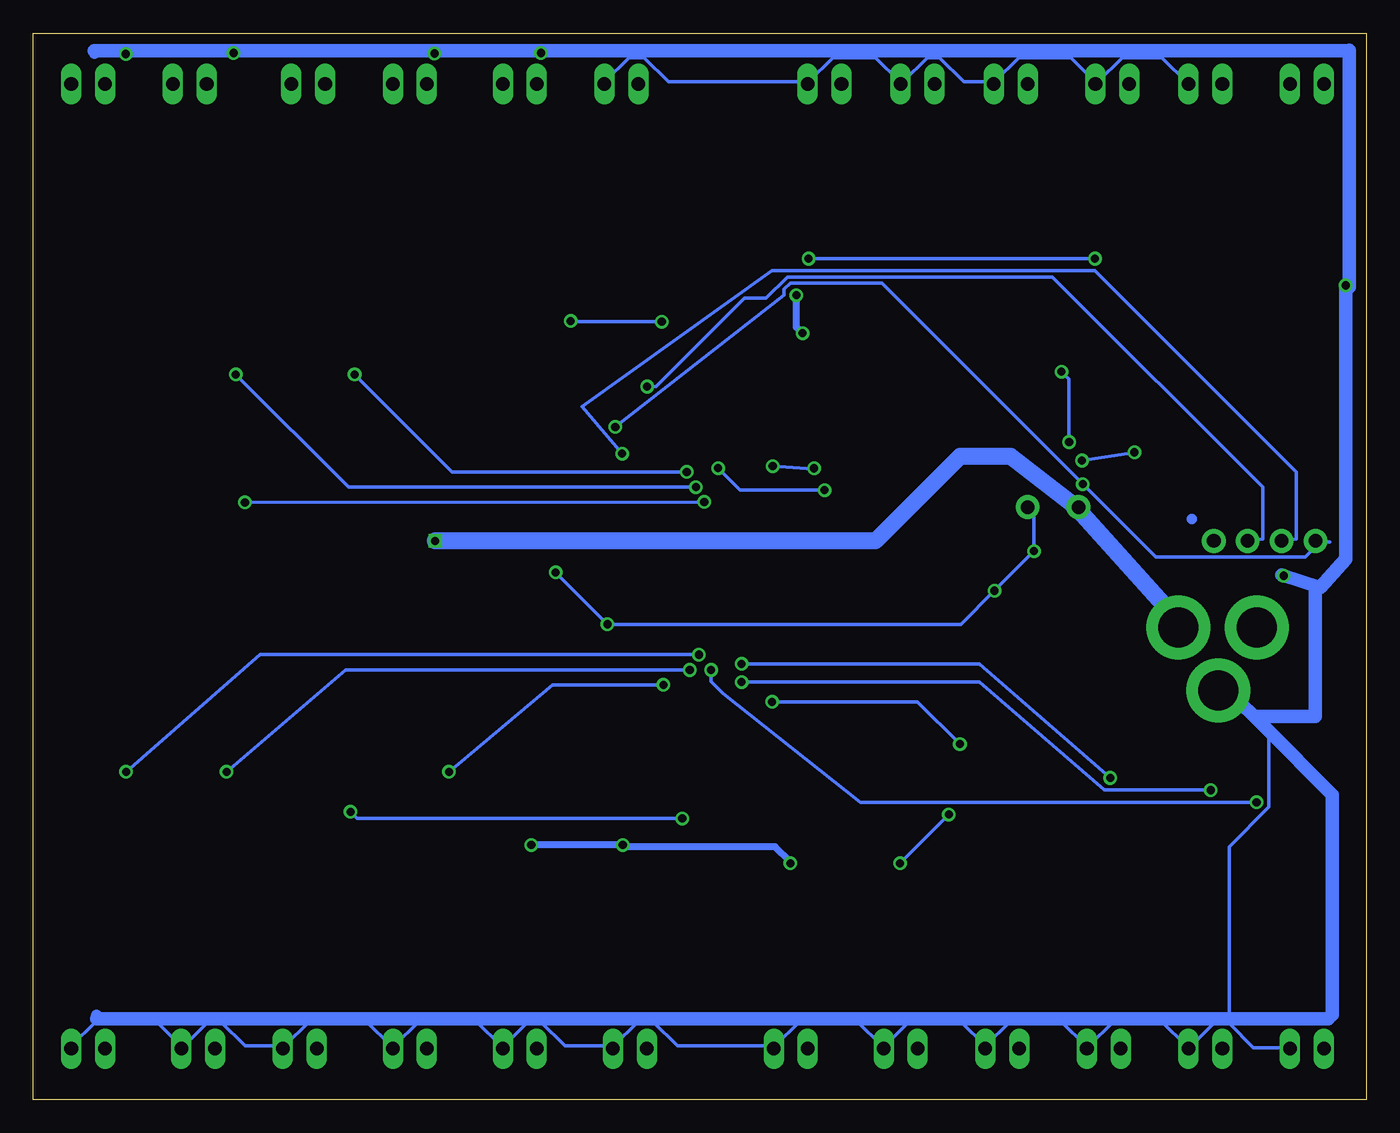
[diagram p3: board, bottom side, seen from below]

Size 100 x 80 mm. Coordinates in mm from the lower left corner, seen from the top.
Outline: 0,0 100,0 100,80 0,80 0,0
Copper layers (1*16): Top 0.035mm / dielectric 1.5mm / Bottom 0.035mm
Design rules "default": minimum track width 10mil, minimum drill 24mil, track to track 8mil, track to pad 8mil, pad to pad 8mil, via to via 8mil, smd to smd 8mil, copper to edge 40mil, drill to drill 8mil, minimum pad ring 10mil, minimum via ring 8mil, stop-mask expansion 4mil, vias tented up to drill 0mil, thermal gap 10mil

### Footprints (pad centres in the part's own frame; a part is rotated, then mirrored left to right if it is on the bottom)
PJ-102A = drill 3 pad 4.8: RING 0.1,-3.39; RING_SW -4.6,-6.29; TIP 0.1,-9.29
C0402 = smd 0.7 x 0.9: 1 -0.65,0; 2 0.65,0
0805 = smd 1.3 x 1.5: 1 -0.95,0; 2 0.95,0
1X04-CLEANBIG = drill 1.016 pad 1.778: 1 -3.81,0; 2 -1.27,0; 3 1.27,0; 4 3.81,0
SOT23 = smd 1 x 1.4: 1 -0.95,-1.1; 2 0.95,-1.1; 3 0,1.1
TO252 = smd 1 x 1.6: 1 -2.28,-4.8; 2 2.28,-4.8 | smd 5.4 x 6.2: 3 0,2.5
HTSSOP32DAP = smd 0.3 x 1.8: 1 -4.875,-3.75; 2 -4.225,-3.75; 3 -3.575,-3.75; 4 -2.925,-3.75; 5 -2.275,-3.75; 6 -1.625,-3.75; 7 -0.975,-3.75; 8 -0.325,-3.75; 9 0.325,-3.75; 10 0.975,-3.75; 11 1.625,-3.75; 12 2.275,-3.75; 13 2.925,-3.75; 14 3.575,-3.75; 15 4.225,-3.75; 16 4.875,-3.75; 17 4.875,3.75; 18 4.225,3.75; 19 3.575,3.75; 20 2.925,3.75; 21 2.275,3.75; 22 1.625,3.75; 23 0.975,3.75; 24 0.325,3.75; 25 -0.325,3.75; 26 -0.975,3.75; 27 -1.625,3.75; 28 -2.275,3.75; 29 -2.925,3.75; 30 -3.575,3.75; 31 -4.225,3.75; 32 -4.875,3.75 | smd 11 x 5.2: EXP 0,0
1X01-CLEANBIG = drill 1.016 pad 1.778: 1 0,0
CHIP-LED0805 = smd 1.2 x 1.2: A 0,-1.05; C 0,1.05
1X02 = drill 1.016 long: 1 -1.27,0; 2 1.27,0
MICRO3 = smd 0.8 x 0.9: 1 -0.95,-1; 2 0.95,-1; 3 0,1
R0402 = smd 0.7 x 0.9: 1 -0.65,0; 2 0.65,0
R1206 = smd 1.6 x 1.803: 1 -1.422,0; 2 1.422,0

### Placement (x,y rotation side)
2.1MM1  4.82,35.3 90 top
C1  54.61,72.39 0 top
C2  62.23,72.39 0 top
C3  71.12,72.39 0 top
C4  78.74,72.39 0 top
C5  87.63,72.39 0 top
C6  95.25,72.39 0 top
C7  3.81,72.39 0 top
C8  11.43,72.39 0 top
C9  19.05,72.39 0 top
C10  26.67,72.39 0 top
C11  33.02,72.39 0 top
C12  40.64,72.39 0 top
C13  40.64,6.35 0 top
C14  33.02,6.35 0 top
C15  25.4,6.35 0 top
C16  17.78,6.35 0 top
C17  11.43,7.62 0 top
C18  3.81,6.35 0 top
C19  96.52,6.35 0 top
C20  87.63,6.35 0 top
C21  80.01,7.62 0 top
C22  71.12,7.62 0 top
C23  63.5,7.62 0 top
C24  55.88,7.62 0 top
C25  30.48,41.91 0 top
C26  30.48,34.29 0 top
C27  30.48,38.1 0 top
CN1  7.62,41.91 180 top
D1  55.88,68.58 90 top
D2  62.23,68.58 90 top
D3  71.12,68.58 90 top
D4  78.74,68.58 90 top
D5  87.63,68.58 90 top
D6  95.25,68.58 90 top
D7  3.81,68.58 90 top
D8  11.43,68.58 90 top
D9  19.05,68.58 90 top
D10  26.67,68.58 90 top
D11  33.02,68.58 90 top
D12  40.64,68.58 90 top
D13  43.18,10.16 90 top
D14  35.56,10.16 90 top
D15  27.94,10.16 90 top
D16  20.32,10.16 90 top
D17  12.7,10.16 90 top
D18  5.08,10.16 90 top
D19  96.52,11.43 90 top
D20  87.63,11.43 90 top
D21  80.01,11.43 90 top
D22  71.12,11.43 90 top
D23  63.5,11.43 90 top
D24  55.88,11.43 90 top
IC1  20.32,35.56 0 top
IC2  50.8,39.37 180 top
JP1  21.59,44.45 0 top
JP2  25.4,44.45 0 top
LED1  55.88,52.07 90 top
LED2  63.5,52.07 90 top
LED3  71.12,52.07 90 top
LED4  78.74,52.07 90 top
LED5  87.63,52.07 270 top
LED6  95.25,52.07 270 top
LED7  5.08,52.07 90 top
LED8  11.43,52.07 90 top
LED9  19.05,52.07 90 top
LED10  26.67,52.07 90 top
LED11  34.29,52.07 90 top
LED12  40.64,50.8 270 top
LED13  43.18,25.4 270 top
LED14  34.29,26.67 90 top
LED15  25.4,25.4 270 top
LED16  19.05,25.4 270 top
LED17  11.43,25.4 270 top
LED18  3.81,25.4 270 top
LED19  95.25,26.67 270 top
LED20  87.63,26.67 270 top
LED21  80.01,26.67 90 top
LED22  71.12,26.67 270 top
LED23  63.5,27.94 90 top
LED24  55.88,27.94 90 top
LED25  64.77,40.64 0 top
M0  55.88,76.2 0 top
M1  63.5,76.2 0 top
M2  71.75,76.2 0 top
M3  79.38,76.2 0 top
M4  88.27,76.2 0 top
M5  95.89,76.2 0 top
M6  4.45,76.2 0 top
M7  12.06,76.2 0 top
M8  19.05,76.2 0 top
M9  26.67,76.2 0 top
M10  33.66,76.2 0 top
M11  40.64,76.2 0 top
M12  43.18,3.81 0 top
M13  34.92,3.81 0 top
M14  27.3,3.81 0 top
M15  19.68,3.81 0 top
M16  12.06,3.81 0 top
M17  4.45,3.81 0 top
M18  95.89,3.81 0 top
M19  87.63,3.81 0 top
M20  80.01,3.81 0 top
M21  71.75,3.81 0 top
M22  63.5,3.81 0 top
M23  55.24,3.81 0 top
Q1  55.88,63.5 0 top
Q2  62.23,63.5 0 top
Q3  71.12,63.5 0 top
Q4  78.74,63.5 0 top
Q5  87.63,63.5 0 top
Q6  95.25,63.5 0 top
Q7  3.81,62.23 0 top
Q8  11.43,62.23 0 top
Q9  19.05,62.23 0 top
Q10  25.4,62.23 0 top
Q11  33.02,62.23 0 top
Q12  40.64,62.23 0 top
Q13  43.18,15.24 180 top
Q14  34.29,15.24 180 top
Q15  25.4,15.24 180 top
Q16  19.05,15.24 180 top
Q17  11.43,15.24 180 top
Q18  3.81,15.24 180 top
Q19  95.25,16.51 180 top
Q20  87.63,16.51 180 top
Q21  80.01,16.51 180 top
Q22  71.12,16.51 180 top
Q23  63.5,16.51 180 top
Q24  55.88,16.51 180 top
R1  55.88,59.69 0 top
R2  62.23,59.69 0 top
R3  71.12,59.69 0 top
R4  55.88,55.88 0 top
R5  63.5,55.88 0 top
R6  71.12,55.88 0 top
R7  78.74,59.69 0 top
R8  87.63,59.69 0 top
R9  95.25,59.69 0 top
R10  78.74,55.88 0 top
R11  87.63,55.88 0 top
R12  95.25,55.88 0 top
R13  5.08,58.42 0 top
R14  11.43,58.42 0 top
R15  17.78,58.42 0 top
R16  5.08,54.61 0 top
R17  11.43,54.61 0 top
R18  19.05,54.61 0 top
R19  26.67,58.42 0 top
R20  33.02,58.42 0 top
R21  40.64,58.42 0 top
R22  26.67,54.61 0 top
R23  34.29,54.61 0 top
R24  40.64,54.61 0 top
R25  43.18,19.05 180 top
R26  34.29,19.05 180 top
R27  25.4,19.05 180 top
R28  43.18,21.59 0 top
R29  34.29,21.59 0 top
R30  25.4,21.59 0 top
R31  19.05,19.05 180 top
R32  11.43,19.05 180 top
R33  3.81,19.05 180 top
R34  19.05,21.59 0 top
R35  11.43,21.59 0 top
R36  3.81,21.59 0 top
R37  95.25,20.32 180 top
R38  87.63,20.32 180 top
R39  80.01,20.32 180 top
R40  95.25,22.86 0 top
R41  87.63,22.86 0 top
R42  80.01,22.86 0 top
R43  71.12,20.32 180 top
R44  63.5,20.32 180 top
R45  55.88,20.32 180 top
R46  71.12,22.86 0 top
R47  63.5,22.86 0 top
R48  55.88,24.13 180 top
R49  27.94,45.72 0 top
R50  59.69,41.91 0 top
R51  59.69,35.56 0 top

### Tracks (layer width: path | path; a pad name or v marks a point on that pad's centre or on a via)
+5V  (via drill 0.61)
  Top 0.254: v60.81,39.55 64.69,39.55 LED25.A | v56.92,35.66 55.78,35.66 IC2.32 | R49.2 31.09,45.72 30.63,45.26 30.63,45.03 30.18,44.58 25.6,44.58 JP2.1 | 26.29,40.46 25.6,40.46 v24.92,41.15 | v27.89,38.18 29.49,38.18 C27.1 29.72,37.95 29.72,34.29 C26.1 29.49,34.29 26.06,30.86 24,30.86 IC1.2
  Bottom 0.254: v60.81,39.55 v56.92,35.66 30.4,35.66 v27.89,38.18 v24.92,41.15 24.92,43.89 25.38,44.35 JP2.1
+12V  (via drill 0.61)
  Top 0.254: 33.83,58.52 R20.2 33.83,58.29 34.29,58.29 | 33.83,61.04 Q11.2 | 41.15,58.29 R21.2 | 39.78,50.98 LED12.A 39.55,50.98 | 35.43,51.89 LED11.A 35.2,51.89 34.75,51.89 | 18.52,58.52 R15.2 | 19.89,61.04 Q9.2 20.12,61.27 | 27.2,58.52 R19.2 27.43,58.29 | 26.52,61.04 Q10.2 26.29,61.27 | 27.89,52.12 LED10.A 27.66,51.89 27.2,51.89 | 5.71,58.52 R13.2 5.94,58.29 | 4.8,61.04 Q7.2 | 12.12,60.81 12.34,61.04 Q8.2 | 12.12,58.52 R14.2 12.12,58.29 | 6.17,51.89 LED7.A | 12.34,51.89 LED8.A 12.57,52.12 | 29.72,41.83 C25.1 29.49,42.06 | 42.06,61.04 41.6,61.04 Q12.2 | 20.12,51.89 LED9.A | 21.49,44.58 JP1.1 21.72,44.35 | 33.38,18.64 33.6,18.87 R26.2 | 33.38,16.36 Q14.2 33.15,16.13 | 18.29,16.36 Q16.2 18.29,16.13 | 18.29,18.87 R31.2 18.29,19.1 17.83,19.1 | 24.46,18.64 24.69,18.87 R27.2 | 24.46,16.36 Q15.2 | 24.23,16.13 Q15.2 | 24.46,16.13 Q15.2 | 42.29,18.64 42.52,18.87 R25.2 42.52,19.1 42.06,19.1 | 42.29,16.36 Q13.2 | 35.43,26.64 LED14.A 35.2,26.87 34.75,26.87 | 42.06,25.5 LED13.A 42.06,25.27 | 2.97,16.36 Q18.2 2.97,16.13 3.43,16.13 | 2.97,18.87 R33.2 2.97,19.1 2.52,19.1 | 10.52,18.64 10.74,18.87 R32.2 | 10.52,16.36 Q17.2 10.29,16.13 | 18.52,25.5 18.06,25.5 LED16.A | 24.23,25.5 LED15.A | 10.52,25.5 LED17.A 10.29,25.6 | 17.83,25.5 LED16.A | 2.74,25.27 LED18.A 2.97,25.6 | 17.83,25.27 LED16.A | 79.1,20.02 79.32,20.24 R39.2 | 79.1,17.73 Q21.2 | 86.87,17.73 Q20.2 86.64,17.5 | 86.87,20.24 R38.2 86.87,20.47 | 79.55,17.5 79.1,17.5 Q21.2 | 94.41,17.73 Q19.2 | 94.41,20.24 R37.2 94.41,20.47 | 81.15,26.64 LED21.A | 86.41,26.64 LED20.A 86.64,26.87 | 94.18,26.87 LED19.A | 55.09,17.73 Q24.2 | 55.09,20.24 R45.2 | 62.64,17.73 Q23.2 | 62.64,20.24 R44.2 62.64,20.47 62.18,20.47 | 70.18,17.73 Q22.2
  Top 0.254: 57.15,28.02 LED24.A | 64.47,28.02 LED23.A 64.69,27.79 | 69.95,26.87 LED22.A | 78.87,17.5 Q21.2 | 63.09,59.89 R2.2 63.09,59.66 | 63.09,62.41 Q2.2 | 56.69,59.89 R1.2 56.69,59.66 | 56.69,62.41 Q1.2 | 58.52,51.89 57.15,51.89 LED1.A | 64.47,51.89 LED2.A | 72.01,51.89 LED3.A 72.24,51.89 | 64.69,51.89 LED2.A | 64.69,52.12 LED2.A | 96.11,59.89 R9.2 95.89,59.66 | 96.11,62.41 Q6.2 96.11,62.64 95.67,62.64 95.66,62.64 | 94.28,52.12 LED6.A | 71.78,62.18 72.01,62.41 Q3.2 72.24,62.64 | 71.78,59.89 R3.2 | 79.55,59.89 R7.2 79.55,59.66 | 79.55,62.41 Q4.2 79.55,62.64 | 88.47,59.89 R8.2 88.24,59.66 | 88.47,62.41 Q5.2 88.7,62.64 | 80.01,52.12 LED4.A 79.78,51.89 | 86.41,52.12 LED5.A 86.64,52.12 | 13.95,35.43 2.1MM1.TIP | 70.41,20.24 70.18,20.02 R43.2 70.41,20.24
  Top 0.508: 42.06,61.04 v42.75,60.35 | R21.2 41.38,58.41 v42.29,57.49 42.18,57.26 40.58,55.66 40.58,51.89 39.78,51.09 LED12.A 39.43,50.98 36.46,50.98 35.55,51.89 LED11.A | Q11.2 33.83,60.92 33.83,58.64 R20.2 | 34.29,58.29 34.4,58.29 37.03,55.66 37.03,53.49 35.66,52.12 LED11.A | R15.2 18.52,58.64 18.52,59.55 19.89,60.92 Q9.2 20.23,61.27 22.97,61.27 23.89,62.18 25.38,62.18 26.18,61.38 Q10.2 26.52,60.92 27.2,60.24 27.2,58.64 R19.2 27.43,58.18 29.38,56.24 29.38,53.49 | 29.38,53.49 28,52.12 LED10.A 27.2,51.78 26.4,50.98 21.03,50.98 20.23,51.78 LED9.A 20,51.89 19.77,51.89 18.86,50.98 | LED11.A 34.75,51.78 34.4,51.44 34.4,51.32 34.06,50.98 32,50.98 29.6,53.38 29.38,53.49 | C25.1 29.38,42.06 25.38,42.06 23.09,44.35 21.83,44.35 JP1.1 21.37,44.58 | Q7.2 4.8,60.92 5.71,60.01 5.71,58.64 R13.2 5.94,58.18 5.94,57.61 7.77,55.78 7.77,51.89 | 12.12,60.81 12.12,58.64 R14.2 12.12,58.18 12.12,57.72 14.17,55.66 14.17,53.49 | 14.17,53.49 12.8,52.12 12.69,52.12 LED8.A 12.23,51.89 11.32,50.98 9.6,50.98 8.69,51.89 7.77,51.89 | 7.77,51.89 6.29,51.89 LED7.A | 18.86,50.98 16.8,50.98 14.4,53.38 14.17,53.49 | 18.97,50.75 18.86,50.98 | 63.09,60.01 63.09,62.29 Q2.2 | 63.09,60.01 R2.2 | Q1.2 56.69,62.29 56.69,60.01 R1.2 56.69,59.55 56.69,58.86 58.64,56.92 58.64,51.89 | 58.64,51.89 59.55,50.98 63.21,50.98 64.12,51.89 64.35,51.89 LED2.A | 58.64,51.89 58.52,51.89 | LED2.A 64.81,51.89 65.72,50.98 66.83,50.62 70.98,50.98 71.89,51.89 LED3.A 72.35,51.89 76.01,51.89 76.92,50.98 78.52,50.98 79.55,52.01 LED4.A 80.12,52.12 81.5,52.12 | 63.09,60.01 63.32,59.89 66.18,57.04 66.18,53.38 64.92,52.12 LED2.A
  Top 0.508: R3.2 71.78,60.01 71.78,62.06 Q3.2 72.35,62.64 76.35,62.64 77.15,63.44 78.64,63.44 79.44,62.64 Q4.2 79.55,62.29 79.55,60.01 R7.2 79.55,59.55 79.55,58.86 81.5,56.92 81.5,52.12 | 81.5,52.12 86.3,52.12 LED5.A 86.75,52.23 86.75,54.06 87.78,55.09 87.78,58.98 88.24,59.44 R8.2 88.47,60.01 88.47,62.29 Q5.2 88.81,62.64 92.93,62.64 93.73,63.44 94.98,63.44 95.67,62.75 95.67,62.64 | Q6.2 96.13,62.29 96.13,60.01 R9.2 95.9,59.44 95.33,58.86 95.33,54.98 94.3,53.95 94.3,52.23 LED6.A | R39.2 79.1,20 79.1,17.83 Q21.2 78.75,17.49 73.61,17.49 72.69,16.57 71.32,16.57 70.41,17.49 Q22.2 70.18,17.83 70.18,19.89 | 79.55,17.5 79.67,17.49 79.67,17.26 80.35,16.57 85.72,16.57 86.53,17.37 Q20.2 86.87,17.83 86.87,20.12 R38.2 86.64,20.23 86.41,20.23 84.47,22.17 84.47,26.63 | 94.41,20.12 94.41,17.83 Q19.2 | 94.41,20.12 R37.2 | 84.47,26.63 86.3,26.63 LED20.A 86.75,26.86 87.67,27.77 89.76,28 90.68,27.08 92.01,26.86 | 84.47,26.63 81.27,26.63 LED21.A | 92.01,26.86 94.07,26.86 LED19.A | 92.01,26.86 92.01,22.29 92.81,21.49 92.93,21.49 94.18,20.23 94.41,20.12 | R44.2 62.64,20.12 v62.64,19.1 62.64,17.83 Q23.2 | R45.2 55.09,20.12 55.78,19.43 v55.78,19.1 55.66,18.86 55.09,18.29 55.09,17.83 Q24.2 | 70.18,19.89 R43.2 | 60.58,28 57.26,28 LED24.A | 60.58,28 61.61,29.03 63.32,29.03 | 63.32,29.03 64.35,28 LED23.A 64.81,27.77 65.72,26.86 67.78,26.86 | 67.78,26.86 69.84,26.86 LED22.A | 67.78,26.86 67.78,22.4 70.07,20.12 70.18,19.89 | 62.18,20.47 62.06,20.46 60.69,21.83 60.69,27.77 60.58,28 | Q18.2 2.97,16.46 2.97,18.75 R33.2 | Q17.2 10.52,16.46 10.52,18.63 R32.2 | 3.43,16.13 3.54,16.12 3.54,15.89 4.12,15.32 9.37,15.32 10.17,16.12 Q17.2
  Top 0.508: R26.2 33.38,18.63 33.38,16.46 Q14.2 33.03,16.12 27.77,16.12 26.98,15.32 25.49,15.32 24.69,16.12 Q15.2 | Q16.2 18.29,16.46 18.29,18.75 R31.2 | 24.46,18.63 24.46,16.46 Q15.2 | 24.46,18.63 R27.2 | Q16.2 18.4,16.12 19.2,15.32 23.32,15.32 24.12,16.12 Q15.2 | Q17.2 10.74,16.23 11.66,15.32 16.92,15.32 17.83,16.23 Q16.2 | R25.2 42.41,18.63 43.2,17.83 v43.2,17.73 43.09,17.49 42.29,16.69 42.29,16.46 Q13.2 | 42.06,19.1 41.95,19.09 40.8,20.23 40.69,20.23 40.46,20.46 40.46,23.89 41.83,25.26 LED13.A 41.95,25.49 40.8,26.63 35.55,26.63 LED14.A 34.75,26.98 34.4,27.32 34.4,27.43 34.06,27.77 26.86,27.77 24.57,25.49 LED15.A 24.12,25.49 22.63,25.49 | LED18.A 3.09,25.6 4,26.52 9.26,26.52 10.17,25.6 LED17.A 10.63,25.49 11.66,26.52 18.06,26.52 | 18.06,26.52 18.06,25.6 LED16.A | 18.06,30.75 IC1.1 17.95,30.98 | 22.63,25.49 21.95,25.49 20.92,26.52 18.06,26.52 | 13.95,34.98 13.95,35.32 2.1MM1.TIP | 22.63,25.49 22.63,20.57 24.35,18.86 24.46,18.63 | 63.44,29.26 63.32,29.03
  Top 0.762: 21.37,44.58 19.39,45.83 19.39,49.61 18.97,50.75 | 18.06,30.75 18.06,26.52 | 66.83,50.62 66.83,31.99 63.44,29.26
  Top 1.27: 17.95,30.98 13.95,34.98
  Bottom 0.254: 21.49,44.35 JP1.1
  Bottom 0.508: v42.75,60.35 42.75,57.95 v42.29,57.49 | v62.64,19.1 62.64,19.09 55.78,19.09 v55.78,19.1 55.55,18.97 44.35,18.97 43.2,17.83 v43.2,17.73 | 21.27,43.88 21.49,44.23 JP1.1 | 13.83,35.66 2.1MM1.TIP
  Bottom 1.27: 13.83,35.66 21.27,43.88
BLANK  (via drill 0.61)
  Top 0.254: 56.81,45.38 63.55,44.58 65.84,42.29 65.84,38.86 60.81,33.83 55.09,33.83 54.41,34.52 54.41,35.43 IC2.30 | 56.81,45.38 55.09,44.12 55.09,43.2 IC2.2 | R49.1 21.72,45.72 v21.26,46.18 | 56.81,45.38 56.79,49.09 v56.34,50.46
  Bottom 0.254: v56.34,50.46 43.66,60.35 43.66,60.81 43.2,61.27 36.35,61.27 v21.26,46.18 15.77,40.69 4.57,40.69 3.43,41.83 2.74,41.83 CN1.4
GND  (via drill 0.61)
  Top 0.254: 41.6,6.76 44.12,9.27 D13.1 | 41.6,6.76 41.38,6.53 C13.2 41.6,6.76 | 41.6,6.76 44.35,4.01 M12.2 | 33.83,6.3 36.12,4.01 M13.2 | 33.83,6.3 36.58,9.04 D14.1 | 33.83,6.3 C14.2 | M14.2 28.57,3.79 26.06,6.3 C15.2 26.06,6.53 28.57,9.04 29.03,9.04 D15.1 | 18.52,6.3 20.8,4.01 M15.2 | 18.52,6.3 21.26,9.04 D16.1 | 18.52,6.3 C16.2 | D18.1 6.17,9.04 6.17,8.13 4.57,6.53 C18.2 4.57,6.17 4.57,5.03 5.71,3.89 M17.2 | D17.1 13.72,9.27 12.12,7.67 C17.2 12.12,7.44 12.12,5.16 13.26,4.01 M16.2 | M18.2 97.16,6.3 C19.2 97.38,6.53 97.61,6.76 97.61,10.41 D19.1 97.84,10.52 98.75,11.43 98.75,65.15 96.47,67.44 D6.1 96.34,67.67 95.2,68.81 95.2,71.55 95.89,72.24 C6.2 96.11,72.47 96.11,75.21 97.03,76.12 M5.2 97.03,76.35 95.2,78.18 91.44,78.18 89.61,76.35 M4.2 | D21.1 80.92,10.41 80.7,10.19 80.7,7.67 C21.2 80.7,7.44 80.7,4.47 81.15,4.01 M20.2 | M19.2 88.47,4.24 88.47,6.3 C20.2 88.47,6.53 88.7,6.76 88.7,10.41 D20.1 | D22.1 72.01,10.41 71.78,10.19 71.78,7.67 C22.2 71.78,7.44 71.78,5.16 72.92,4.01 M21.2 | D24.1 56.92,10.41 56.69,10.19 56.69,7.67 C24.2 56.46,7.44 56.46,4.01 M23.2 | D23.1 64.47,10.41 64.24,10.19 64.24,7.67 C23.2 64.24,7.44 64.24,4.47 64.69,4.01 M22.2 | 56.24,42.52 55.78,42.98 IC2.1 | 56.24,42.52 56.69,42.06 58.98,42.06 R50.1 59.21,41.83 59.21,39.78 60.12,38.86 60.12,35.66 R51.2 | 56.24,42.52 53.26,39.55 50.98,39.55 IC2.EXP 50.75,39.32 31.55,39.32 | C26.2 31.55,34.29 31.55,37.95 C27.2 31.55,38.18 31.55,39.32 | 31.55,39.32 31.55,41.83 C25.2 | M11.2 41.38,75.67 41.38,72.47 C12.2 41.15,72.24 40.69,71.78 40.69,68.58 41.6,67.67 D12.1 | M9.2 27.89,76.12 27.43,75.67 27.43,72.47 C10.2 27.43,72.24 28.8,70.87 28.8,68.58 27.89,67.67 D10.1
  Top 0.254: M10.2 34.75,76.12 33.83,75.21 33.83,72.47 C11.2 33.83,72.24 35.2,70.87 35.2,68.58 34.29,67.67 D11.1 | M8.2 20.12,76.12 19.89,75.89 19.89,72.47 C9.2 19.89,72.24 21.26,70.87 21.26,68.58 20.34,67.67 D9.1 | D8.1 12.34,67.67 11.43,68.58 11.43,71.55 12.12,72.24 C8.2 12.12,72.47 12.12,74.98 M7.2 13.26,76.35 11.43,78.18 10.29,78.18 8.46,76.35 5.71,76.35 M6.2 5.71,76.12 4.57,74.98 4.57,72.47 C7.2 4.57,72.24 5.94,70.87 5.94,68.58 5.03,67.67 D7.1 4.8,67.44 4.8,62.87 4.34,62.41 2.81,62.47 2.36,62.47 1.84,61.95 1.54,61.1 1.6,61.04 v1.54,61.09 | D1.1 57.15,67.67 58.06,68.58 58.06,70.18 56.01,72.24 55.32,72.24 C1.2 55.32,72.47 55.32,74.3 57.15,76.12 M0.2 57.15,76.35 59.89,76.35 61.72,78.18 62.87,78.18 64.69,76.35 M1.2 | M1.2 63.09,74.52 63.09,72.47 C2.2 62.87,72.24 62.18,71.55 62.18,68.81 63.32,67.67 D2.1 | M4.2 89.38,76.12 88.47,75.21 88.47,72.47 C5.2 88.47,72.24 89.84,70.87 89.84,68.58 88.92,67.67 D5.1 | M2.2 72.92,76.12 71.78,74.98 71.78,72.47 C3.2 71.78,72.24 71.09,71.55 71.09,68.58 72.01,67.67 D3.1 | M3.2 80.47,76.12 79.55,75.21 79.55,72.47 C4.2 79.55,72.24 80.92,70.87 80.92,68.58 80.01,67.67 D4.1 | M2.2 73.15,76.35 75.89,76.35 77.72,78.18 78.64,78.18 80.47,76.35 M3.2 | M4.2 87.55,78.18 82.53,78.18 80.7,76.35 M3.2 | M1.2 64.92,76.35 68.12,76.35 69.95,78.18 71.09,78.18 72.92,76.35 M2.2 | 31.55,39.32 27.66,39.32 26.52,38.18 21.72,38.18 IC1.3 21.49,38.18 15.09,38.18 14.86,38.41 10.29,38.41 10.16,38.48 10.36,38.48 | 10.74,31.09 2.1MM1.RING_SW
  Top 0.406: CN1.1 10.16,38.48 | 2.1MM1.RING 9.26,35.4
  Top 0.508: 10.29,38.41 10.86,37.52 11.41,32.62 10.74,31.09
  Top 0.762: 10.16,38.48 9.26,38.48 | 9.26,38.48 8.39,39.34 6.33,39.34 | 9.26,35.4 9.26,38.48
  Bottom 0.254: 28.57,4.01 26.75,5.84 22.86,5.84 21.03,4.01 M15.2 20.8,4.01 18.97,5.84 15.32,5.84 13.49,4.01 M16.2 11.43,5.71 10.29,5.71 | 28.57,4.01 30.4,5.84 34.29,5.84 36.12,4.01 M13.2 36.35,4.01 38.18,5.84 42.52,5.84 44.35,4.01 M12.2 44.58,4.01 51.66,4.01 53.49,5.84 54.63,5.84 56.46,4.01 M23.2 56.69,4.01 60.12,4.01 61.95,5.84 62.87,5.84 64.69,4.01 M22.2 64.92,4.01 66.75,5.84 71.09,5.84 72.92,4.01 M21.2 73.15,4.01 74.98,5.84 79.32,5.84 81.15,4.01 M20.2 81.38,4.01 84.12,4.01 85.95,5.84 86.87,5.84 M19.2 88.92,4.01 90.75,5.84 95.33,5.84 97.16,4.01 M18.2 | 28.57,4.01 M14.2 | M7.2 15.32,78.18 18.29,78.18 20.12,76.35 M8.2 20.34,76.35 22.17,78.18 26.06,78.18 27.89,76.35 M9.2 28.12,76.35 30.18,76.35 32,78.18 32.92,78.18 34.75,76.35 M10.2 34.98,76.35 36.8,78.18 40.01,78.18 41.83,76.35 M11.2 42.06,76.35 52.35,76.35 54.18,78.18 55.32,78.18 57.15,76.35 M0.2 | 10.29,5.71 8.46,3.89 5.71,3.89 M17.2 | 10.29,5.71 10.29,18.97 7.32,21.95 7.32,27.66 | 10.52,30.86 2.1MM1.RING_SW
  Bottom 1.016: 10.52,30.86 7.32,27.66 | 6.35,39.37 3.45,38.4 1.51,40.56 v1.54,61.09
N$1
  Top 0.254: R50.2 60.35,41.83 64.69,41.83 LED25.C
N$2
  Top 0.254: R51.1 58.98,35.43 58.06,35.43 56.92,34.29 55.32,34.29 55.09,34.52 55.09,35.43 IC2.31
N$3
  Top 0.254: LED13.C 44.35,25.27 44.35,21.84 44.58,21.61 R28.2
N$4  (via drill 0.61)
  Top 0.762: v69.85,41.91 70.16,39.91 66.81,36.57
  Bottom 1.27: 21.54,44.25 26.67,48.26 30.48,48.26 36.83,41.91 v69.85,41.91
N$5
  Top 0.254: 42.98,14.07 Q13.3 42.98,13.95 42.98,10.97 42.29,10.29 D13.3 | 42.29,10.19 D13.3 | C13.1 40.01,6.3 40.01,5.84 40.12,5.83 41.83,4.12 M12.1 41.83,4.01 | 42.06,9.96 D13.3 | 40.01,6.53 C13.1 | C13.1 40.01,6.63 40.01,7.77 42.06,9.83 D13.3
N$6
  Top 0.254: LED14.C 33.38,26.64 33.38,23.9 35.66,21.61 R29.2
N$7  (via drill 0.61)
  other vias: 6.19,39.3
N$8
  Top 0.254: 34.29,10.19 D14.3 | 32.46,6.3 C14.1 | 33.6,4.01 M13.1 33.6,4.12 32.46,5.26 32.46,6.17 C14.1 | 34.29,9.96 D14.3 | 32.46,6.53 C14.1 | Q14.3 34.29,10.29 D14.3 | C14.1 32.46,6.63 32.46,8 34.29,9.83 D14.3
N$9
  Top 0.254: LED15.C 26.52,25.27 26.52,21.84 26.75,21.61 R30.2
N$10
  Top 0.762: 66.78,35.6 81.73,35.56 89.81,27.97
N$11
  Top 0.254: 25.6,14.07 Q15.3 25.6,13.95 25.6,11.43 26.75,10.29 D15.3 | 26.75,10.19 D15.3 | 24.92,6.3 C15.1 | 26.75,9.96 D15.3 | 24.92,6.53 C15.1 | C15.1 24.92,6.17 24.92,4.92 25.95,3.89 M14.1 | D15.3 26.75,9.83 26.75,8.46 24.92,6.63 C15.1
N$12
  Top 0.254: LED16.C 20.12,25.27 20.12,21.84 20.34,21.61 R34.2
N$13
  Top 0.762: 81.28,35.56 81.28,39.37 93.98,52.07
N$14
  Top 0.254: 19.2,14.07 Q16.3 19.2,13.95 19.2,10.29 D16.3 | 19.2,10.19 D16.3 | 17.14,6.3 C16.1 | 18.29,4.01 M15.1 18.29,4.12 17.14,5.26 17.14,6.17 C16.1 | 19.2,9.96 D16.3 | 17.14,6.53 C16.1 | C16.1 17.14,6.63 17.14,7.77 19.2,9.83 D16.3
N$15
  Top 0.254: LED17.C 12.57,25.27 12.57,21.84 12.8,21.61 R35.2
N$16
  Bottom 1.016: 1.27,60.96 1.27,78.74
N$17
  Top 0.254: 10.97,7.67 C17.1 | D17.3 11.43,9.96 10.97,9.5 10.97,7.77 C17.1 | 11.43,10.19 D17.3 | 10.74,4.01 M16.1 10.74,4.12 10.74,7.32 C17.1 | 10.74,7.44 C17.1 | Q17.3 11.43,10.29 D17.3
N$18
  Top 0.254: LED18.C 5.03,25.27 5.03,21.61 R36.2
N$19
  Bottom 0.813: 95.41,78.7 95.41,78.49
  Bottom 1.016: 1.32,78.7 95.41,78.7
N$20
  Top 0.254: 3.89,14.07 Q18.3 3.89,13.95 3.89,10.29 D18.3 | 3.89,10.19 D18.3 | 3.2,6.3 C18.1 | 3.2,4.01 M17.1 3.2,4.12 3.2,6.17 C18.1 | C18.1 3.2,6.4 3.2,9.37 3.89,10.06 D18.3
N$21
  Top 0.254: LED19.C 96.47,26.64 96.47,22.99 R40.2
N$22  (via drill 0.61)
  other vias: 93.06,78.45
N$23
  Top 0.254: 95.33,15.44 Q19.3 95.33,15.32 95.33,11.66 D19.3 | 95.33,11.56 D19.3 | 95.78,6.3 C19.1 | 94.64,4.01 M18.1 94.64,4.12 95.78,5.26 95.78,6.17 C19.1 | 95.56,11.33 D19.3 | C19.1 95.78,6.53 95.56,6.76 95.56,11.2 D19.3
N$24
  Top 0.254: LED20.C 88.7,26.64 88.7,23.22 88.92,22.99 R41.2
N$25  (via drill 0.61)
  other vias: 84.98,78.53
N$26
  Top 0.254: 87.55,15.44 Q20.3 87.55,15.32 87.55,12.57 86.64,11.66 D20.3 | 86.64,11.56 D20.3 | 86.87,4.47 86.41,4.01 M19.1 86.87,4.57 86.87,6.17 C20.1 | 86.87,6.3 C20.1 | 86.64,11.33 D20.3 | C20.1 86.87,6.53 86.64,6.76 86.64,11.2 D20.3
N$27
  Top 0.254: LED21.C 79.1,26.64 79.1,25.27 81.38,22.99 R42.2
N$28  (via drill 0.61)
  other vias: 69.9,78.49
N$29
  Top 0.254: 79.1,11.56 D21.3 | 79.32,4.47 78.87,4.01 M20.1 79.32,4.57 79.32,7.32 C21.1 | 79.32,7.44 C21.1 | Q21.3 80.01,12.57 79.1,11.66 D21.3 | C21.1 79.32,7.66 79.32,11.2 79.1,11.43 D21.3
N$30
  Top 0.254: LED22.C 72.24,26.64 72.24,23.22 72.47,22.99 R46.2
N$31  (via drill 0.61)
  other vias: 61.91,78.53
N$32
  Top 0.254: 71.09,15.44 Q22.3 71.09,15.32 71.09,12.57 70.18,11.66 D22.3 | 70.18,11.56 D22.3 | 70.41,7.44 C22.1 | 70.41,4.01 M21.1 70.41,4.12 70.41,7.32 C22.1 | 70.18,7.9 70.41,7.67 C22.1 | 70.18,11.33 D22.3 | C22.1 70.18,8 70.18,11.2 D22.3
N$33
  Top 0.254: LED23.C 62.64,27.79 62.64,25.04 64.69,22.99 R47.2
N$34
  Bottom 0.813: 2.54,6.35 2.83,6.06 | 95.25,6.06 95.25,6.35
  Bottom 1.016: 7.62,27.94 2.54,22.86 2.54,6.35 | 2.83,6.06 95.25,6.06
N$35
  Top 0.254: 63.32,15.44 Q23.3 63.32,15.32 63.32,12.57 62.41,11.66 D23.3 | 62.41,11.56 D23.3 | 62.64,4.24 62.41,4.01 M22.1 62.64,4.34 62.64,7.32 C23.1 | 62.64,7.44 C23.1 | 62.41,11.33 D23.3 | 62.64,7.67 C23.1 | C23.1 62.64,7.77 62.64,10.97 62.41,11.2 D23.3
N$36
  Top 0.254: LED24.C 54.63,27.79 54.63,24.13 R48.2
N$37
  Bottom 1.016: 8.21,28.76 3.81,28.76 3.81,38.31
N$38
  Top 0.254: 55.09,11.1 54.86,11.33 D24.3 | 55.09,7.67 C24.1 | 55.78,15.44 Q24.3 55.78,15.32 55.78,12.57 54.86,11.66 D24.3 | 54.86,11.56 D24.3 | 54.18,4.01 M23.1 54.18,4.12 54.18,6.4 55.09,7.32 C24.1 | 55.09,7.44 C24.1 | C24.1 55.09,7.77 55.09,11.09 D24.3
N$39
  Top 0.254: LED1.C 54.86,52.12 54.86,53.49 57.15,55.78 R4.2
N$41
  Top 0.254: 55.78,64.69 Q1.3 55.78,64.81 55.78,67.55 54.86,68.47 D1.3 | 54.86,68.58 D1.3 | 54.18,75.89 54.41,76.12 M0.1 54.18,75.78 54.18,72.58 C1.1 | 54.18,72.47 C1.1 | 54.63,68.58 D1.3 | C1.1 54.18,72.35 54.18,69.15 54.63,68.69 D1.3
N$42
  Top 0.254: LED2.C 62.64,52.12 62.64,53.72 64.69,55.78 R5.2
N$44
  Top 0.254: 62.18,64.69 Q2.3 62.18,64.81 62.18,67.55 61.49,68.24 D2.3 | D2.3 61.27,68.58 61.49,68.35 D2.3 | 61.49,72.24 C2.1 | 62.18,76.12 M1.1 62.18,76.01 62.18,72.92 61.72,72.47 61.61,72.47 C2.1 | C2.1 61.49,72.12 61.49,68.92 61.27,68.69 D2.3
N$45
  Top 0.254: LED3.C 70.18,52.12 70.18,53.49 72.47,55.78 R6.2
N$47
  Top 0.254: 71.09,64.69 Q3.3 71.09,64.81 71.09,67.55 70.18,68.47 D3.3 | 70.41,76.12 M2.1 70.41,76.01 70.41,72.47 C3.1 70.41,72.24 70.18,72.01 70.18,68.69 D3.3 | 70.18,68.58 D3.3
N$48
  Top 0.254: LED4.C 77.72,52.12 77.72,53.49 80.01,55.78 R10.2
N$50
  Top 0.254: 78.64,64.69 Q4.3 78.64,64.81 78.64,67.55 77.72,68.47 D4.3 | 78.18,72.47 C4.1 | 78.18,76.12 M3.1 78.18,76.01 78.18,72.58 C4.1 | 77.72,68.58 D4.3 | C4.1 78.07,72.35 78.07,72.24 77.95,72.24 77.72,72.01 77.72,68.69 D4.3
N$51
  Top 0.254: LED5.C 88.7,52.12 88.7,55.55 88.92,55.78 R11.2
N$53
  Top 0.254: 87.55,64.69 Q5.3 87.55,64.81 87.55,67.55 86.64,68.47 D5.3 | 87.1,72.47 C5.1 | 87.1,76.12 M4.1 87.1,76.01 87.1,72.58 C5.1 | 86.64,68.58 D5.3 | C5.1 86.87,72.24 86.64,72.01 86.64,68.69 D5.3
N$54
  Top 0.254: LED6.C 96.34,52.12 96.34,55.55 96.57,55.78 R12.2
N$56
  Top 0.254: 95.2,64.69 Q6.3 95.21,64.81 95.21,67.55 94.3,68.47 D6.3 | 94.51,72.47 C6.1 | 94.51,76.12 M5.1 94.53,76.01 94.53,72.58 C6.1 | 94.28,68.58 D6.3 | C6.1 94.51,72.24 94.28,72.01 94.3,71.89 94.3,68.69 D6.3
N$57
  Top 0.254: LED7.C 4.12,52.12 6.4,54.41 R16.2
N$59
  Top 0.254: 3.66,63.32 Q7.3 3.66,63.44 3.66,67.55 2.74,68.47 D7.3 | 3.2,72.47 C7.1 | 3.2,76.12 M6.1 3.2,76.01 3.2,72.58 C7.1 | 2.74,68.58 D7.3 | 2.97,72.24 C7.1 | C7.1 2.97,72.12 2.97,68.92 2.74,68.69 D7.3
N$60
  Top 0.254: LED8.C 10.52,52.12 12.8,54.41 R17.2
N$62
  Top 0.254: 10.74,72.47 C8.1 | 10.74,76.12 M7.1 10.74,76.01 10.74,72.58 C8.1 | 10.52,68.58 D8.3 | 10.74,72.24 C8.1 | Q8.3 11.43,67.55 10.52,68.47 D8.3 | C8.1 10.74,72.12 10.74,68.92 10.52,68.69 D8.3
N$63
  Top 0.254: LED9.C 18.06,52.12 20.34,54.41 R18.2
N$65
  Top 0.254: 18.97,63.32 Q9.3 18.97,63.44 18.97,67.55 18.29,68.24 D9.3 | D9.3 18.06,68.58 18.29,68.35 D9.3 | 18.29,72.24 C9.1 | 17.83,76.12 M8.1 17.83,76.01 17.83,73.04 18.29,72.58 C9.1 | 18.29,72.47 C9.1 | C9.1 18.29,72.12 18.29,68.92 18.06,68.69 D9.3
N$66
  Top 0.254: LED10.C 25.83,52.12 28.12,54.41 R22.2
N$68
  Top 0.254: 25.38,63.32 Q10.3 25.38,63.44 25.38,68.47 D10.3 | 25.38,68.58 D10.3 | 25.83,75.89 25.6,76.12 M9.1 25.83,75.78 25.83,72.58 C10.1 | 25.83,72.47 C10.1 | 25.6,68.58 D10.3 | 25.83,72.24 C10.1 | C10.1 25.83,72.12 25.83,68.92 25.6,68.69 D10.3
N$69
  Top 0.254: LED11.C 33.38,52.12 35.66,54.41 R23.2
N$71
  Top 0.254: 32.92,63.32 Q11.3 32.92,63.44 32.92,67.55 32,68.47 D11.3 | 32.46,72.47 C11.1 | 32.46,76.12 M10.1 32.46,76.01 32.46,72.58 C11.1 | 32,68.58 D11.3 | C11.1 32.35,72.35 32.35,72.24 32.23,72.24 32,72.01 32,68.69 D11.3
N$72
  Top 0.254: LED12.C 41.83,50.98 41.83,54.41 R24.2
N$74
  Top 0.254: 40.46,63.32 Q12.3 40.46,63.44 40.46,67.55 39.78,68.24 D12.3 | D12.3 39.78,68.35 D12.3 | 39.78,72.24 C12.1 | 39.55,76.12 M11.1 39.55,76.01 39.55,72.69 39.78,72.47 C12.1 | C12.1 39.78,72.12 39.78,68.92 39.55,68.69 D12.3
OUT0
  Top 0.254: Q1.1 55.09,62.41 55.09,59.89 R1.1 55.09,59.66 55.09,56.46 54.63,56.01 R4.1 54.41,56.01 52.95,55.26 52.95,50.32 53.03,48.92 53.03,43.2 IC2.5
OUT1  (via drill 0.61)
  Top 0.254: Q2.1 61.49,62.41 61.49,59.89 R2.1 61.72,59.66 61.95,59.44 61.95,56.01 R5.1 59.69,58.27 v59.69,58.42 | IC2.6 52.42,50.22 52.06,50.58 52.06,57.57 v52.85,58.36
  Bottom 0.254: v52.85,58.36 59.63,58.36 v59.69,58.42
OUT2
  Top 0.254: IC2.7 51.89,43.2 51.89,49.38 51.21,50.06 51.21,60.12 54.41,63.32 69.27,63.32 69.95,62.64 Q3.1 70.18,62.41 70.41,62.18 70.41,59.89 R3.1 70.41,59.66 69.72,58.98 69.72,56.01 R6.1
OUT3  (via drill 0.61)
  Top 0.254: Q4.1 77.95,62.41 77.95,59.89 R7.1 77.95,59.66 77.95,56.46 77.5,56.01 R10.1 77.27,55.78 v75.89,54.41 | v50.98,47.09 51.21,46.86 51.21,43.2 IC2.8
  Bottom 0.254: v50.98,47.09 68.58,47.09 v75.89,54.41
OUT4  (via drill 0.61)
  Top 0.254: Q5.1 86.87,62.41 86.87,59.89 R8.1 86.87,59.66 86.87,56.46 86.41,56.01 R11.1 86.18,55.78 v84.81,54.41 | v50.29,45.95 50.52,45.72 50.52,43.2 IC2.9
  Bottom 0.254: v50.29,45.95 76.35,45.95 v84.81,54.41
OUT5  (via drill 0.61)
  Top 0.254: Q6.1 94.51,62.41 94.51,59.89 R9.1 94.51,59.66 94.51,56.46 94.06,56.01 R12.1 93.83,55.78 v84.12,44.81 | v49.66,44.84 49.84,44.58 49.84,43.2 IC2.10
  Bottom 0.254: v84.12,44.81 v49.66,44.84
OUT6  (via drill 0.61)
  Top 0.254: Q7.1 2.97,61.04 4.34,59.66 4.34,58.52 R13.1 4.34,58.29 3.89,57.84 3.89,54.63 R16.1 2.54,53.49 2.54,49.53 3.47,48.6 15.88,48.6 v17.39,48.56 | IC2.11 49.22,43.74 48.79,44.59 48.74,47.67 v48.62,47.37 | v40.64,45.72 34.29,45.72 33.02,46.99 22.28,46.99 v21.33,47.95
  Bottom 0.254: v48.62,47.37 46.97,45.72 v40.64,45.72 | v21.33,47.95 v17.39,48.56
OUT7
  Top 0.254: IC2.12 48.51,43.22 48.12,45.64 46.57,47.21 46.57,48.59 46.92,48.94 46.92,50.25 47.66,50.99 47.66,52.83 48.21,53.38 48.21,55.94 48.72,56.45 48.46,72.01 42.29,78.18 17.37,78.18 14.63,75.44 14.63,64.92 10.97,61.27 10.52,61.27 Q8.1 10.52,61.04 10.74,60.81 10.74,58.52 R14.1 10.74,58.29 10.06,57.61 10.06,54.63 R17.1
OUT8  (via drill 0.61)
  Top 0.254: v41.83,63.09 47.78,57.15 45.72,46.99 47.7,44.82 47.91,43.09 IC2.13 | v20.34,63.09 18.29,61.04 Q9.1 18.06,61.04 17.14,60.12 17.14,58.52 R15.1 17.14,58.29 17.6,57.84 17.6,54.63 R18.1
  Bottom 0.254: v20.34,63.09 v41.83,63.09
OUT9  (via drill 0.61)
  Top 0.254: Q10.1 24.46,61.04 24.46,59.89 25.83,58.52 R19.1 25.83,58.29 25.38,57.84 25.38,54.63 R22.1 v22.86,54.61 | IC2.14 47.1,44.63 v44.53,47.52 | v41.43,47.36 35.05,47.36 34.09,48.32 23.3,48.32 v22.29,49.33
  Bottom 0.254: v44.53,47.52 41.47,47.32 v41.43,47.36 | v22.29,49.33 22.29,54.04 v22.86,54.61
OUT10
  Top 0.254: IC2.15 46.63,43.2 46.33,44.52 43.33,47.34 46.63,55.09 41.38,60.35 41.15,60.35 40.46,61.04 40.46,61.95 40.23,62.18 33.15,62.18 32.23,61.27 Q11.1 32.23,61.04 32.23,58.52 R20.1 32.46,58.29 32.69,58.06 32.69,54.63 R23.1
OUT11
  Top 0.254: 39.78,59.21 39.78,58.52 R21.1 39.78,58.29 39.32,57.84 39.32,54.63 R24.1 | 39.78,59.21 39.78,61.04 Q12.1 | 39.78,59.21 41.83,59.21 45.95,55.09 42.57,47.16 45.54,43.82 45.95,43.2 IC2.16
OUT12
  Top 0.254: Q13.1 44.12,16.36 44.12,18.64 43.89,18.87 R25.1 43.66,19.1 43.66,19.56 41.83,21.39 R28.1 41.83,21.61 43.2,22.99 43.2,31.34 45.95,35.48 45.95,35.43 IC2.17
OUT13  (via drill 0.61)
  Top 0.254: 35.2,17.73 35.2,18.64 34.98,18.87 R26.1 | 35.2,17.73 35.2,16.36 Q14.1 | 35.2,17.73 v34.98,17.73 | R29.1 32.69,21.39 v31.32,21.39 30.48,22.23 v30.48,26.67 | IC2.18 46.58,34.64 45.34,33.4 45.34,30.61 v44.58,29.84
  Bottom 0.254: v34.98,17.73 v31.32,21.39 | v44.58,29.84 33.66,29.84 v30.48,26.67
OUT14
  Top 0.254: Q15.1 26.29,16.36 26.29,18.64 26.06,18.87 R27.1 | IC2.19 47.09,35.43 47.09,34.29 45.95,33.15 45.95,16.59 44.81,15.44 40.01,15.44 35.43,20.02 26.98,20.02 26.06,19.1 R27.1 | R30.1 24,21.39 25.83,19.56 25.83,19.1 R27.1
OUT15  (via drill 0.61)
  Top 0.254: Q16.1 19.89,16.36 19.89,18.87 R31.1 19.66,19.1 19.66,19.56 17.83,21.39 R34.1 17.83,21.61 19.2,22.99 v19.2,24.13 | v46.86,32.69 47.78,33.6 47.78,35.43 IC2.20
  Bottom 0.254: v46.86,32.69 29.03,32.69 v19.2,24.13
OUT16  (via drill 0.61)
  Top 0.254: Q17.1 12.34,16.36 12.34,18.64 12.12,18.87 R32.1 11.89,19.1 11.89,19.56 10.06,21.39 R35.1 10.06,21.61 v11.66,23.22 | v46.86,31.32 48.46,32.92 48.46,35.43 IC2.21
  Bottom 0.254: v46.86,31.32 29.03,31.32 19.66,23.22 v11.66,23.22
OUT17  (via drill 0.61)
  Top 0.254: 4.57,18.64 4.57,18.87 R33.1 | 4.57,18.64 4.57,16.36 Q18.1 | v49.15,32.23 49.15,35.43 IC2.22 | 4.57,18.64 v8.23,22.3 | 4.57,18.64 R33.1 | R36.1 2.52,21.39 4.34,19.56 4.34,19.1 R33.1
  Bottom 0.254: v49.15,32.23 49.15,31.37 48.26,30.48 37.95,22.3 v8.23,22.3
OUT18  (via drill 0.61)
  Top 0.254: Q19.1 96.01,17.73 96.01,20.24 R37.1 95.78,20.47 95.78,20.93 93.95,22.76 R40.1 93.73,22.99 93.04,23.67 v93.04,24.59 | v50.06,33.38 49.84,33.6 49.84,35.43 IC2.23
  Bottom 0.254: v50.06,33.38 82.98,33.38 v93.04,24.59
OUT19  (via drill 0.61)
  Top 0.254: Q20.1 88.47,17.73 88.47,20.24 R38.1 88.24,20.47 88.24,20.93 86.41,22.76 R41.1 86.18,22.99 85.5,23.67 v85.5,24.59 | v50.75,32.23 50.98,32.46 50.98,33.83 50.52,34.29 50.52,35.43 IC2.24
  Bottom 0.254: v50.75,32.23 76.58,32.23 v85.5,24.59
OUT20  (via drill 0.61)
  Top 0.254: Q21.1 80.92,17.73 80.92,20.02 80.7,20.24 R39.1 80.47,20.47 80.47,20.93 78.64,22.76 R42.1 77.32,21.59 v76.2,21.59 | IC2.25 51.1,34.42 51.66,33.85 51.69,33.02 52.07,32.64 52.07,32 51.31,31.24 v51.31,21.08
  Bottom 0.254: v51.31,21.08 75.69,21.08 v76.2,21.59
OUT21  (via drill 0.61)
  Top 0.254: Q22.1 72.01,17.73 72.01,20.02 71.78,20.24 R43.1 71.55,20.47 71.55,20.93 69.72,22.76 R46.1 69.49,22.99 68.81,23.67 v68.81,24.59 | v52.73,31.11 53.34,32.89 51.66,34.57 51.66,35.43 IC2.26
  Bottom 0.254: v52.73,31.11 61.04,31.09 v68.81,24.59
OUT22
  Top 0.254: IC2.27 52.35,35.43 52.35,34.65 53.85,33.15 53.85,31.11 53.72,30.99 53.72,26.92 52.32,25.53 52.32,23.88 52.35,18.64 54.41,16.59 63.32,16.59 64.24,17.5 Q23.1 64.24,17.73 64.24,20.24 R44.1 64.01,20.47 62.18,22.3 62.18,22.76 R47.1
OUT23
  Top 0.254: Q24.1 56.69,17.73 56.69,20.24 R45.1 56.69,20.47 56.69,23.67 57.15,24.13 | 57.15,24.13 55.91,25.5 55.91,28.96 54.23,33.66 arc104 53.85,34.16 arc-78 53.16,34.75 53.03,35.43 IC2.28 | 57.15,24.13 R48.1
SCLK  (via drill 0.61)
  Top 0.254: IC2.3 54.41,43.2 54.43,44.29 56.25,46.12 56.23,48.06 v55.83,48.46
  Bottom 0.254: v55.83,48.46 58.85,51.99 44.58,62.18 20.34,62.18 5.26,47.09 5.26,42.06 CN1.3
SIN  (via drill 0.61)
  Top 0.254: v53.95,53.49 53.72,53.26 53.72,43.2 IC2.4
  Bottom 0.254: v53.95,53.49 53.26,53.49 46.63,60.12 45.03,60.12 43.43,61.72 23.55,61.72 7.77,45.95 7.77,42.06 CN1.2
(copper drawn outside any net)
  shapes: Bottom circle x1

### Text on the board
tNames: + | + | + | + | + | + | + | + | + | + | + | + | + | BLANK | SCLK | SIN | GND | + | + | + | + | + | + | + | + | + | + | + | +